# Altium project Ixora.PrjPCB (part 1 of 3)
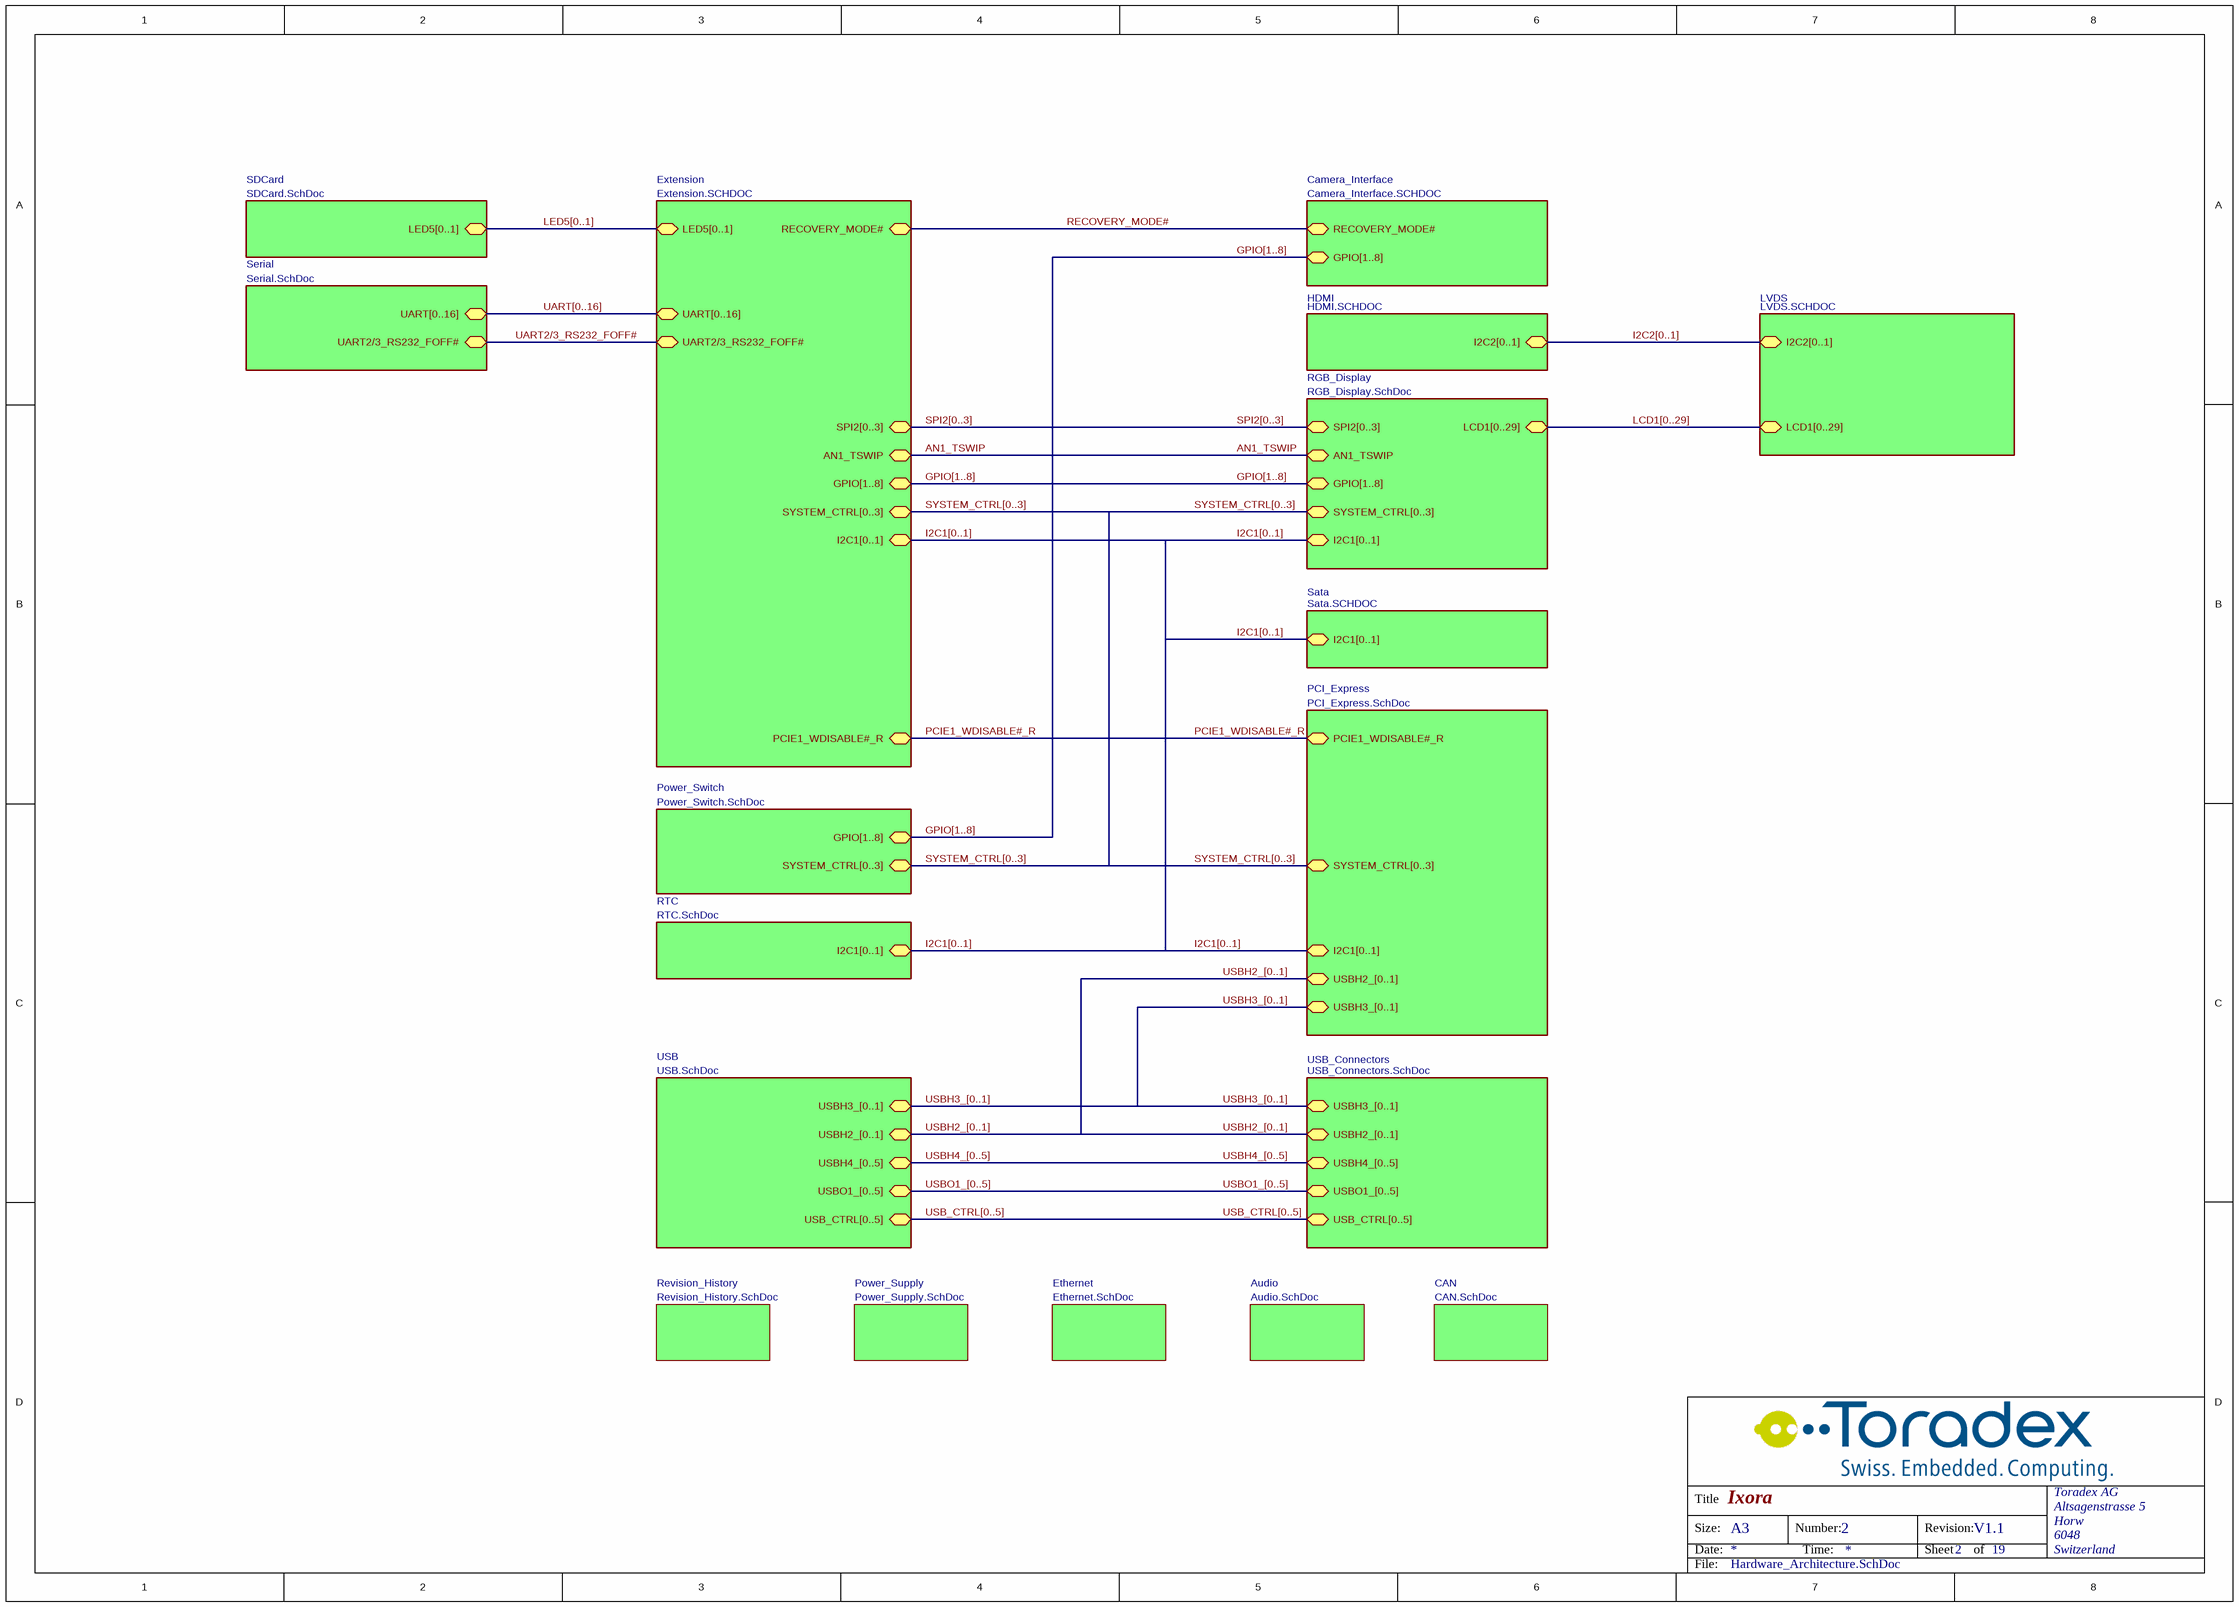
[diagram p0: Hardware_Architecture.SchDoc]
16 sheets, 410 parts. Net scope: global (net labels, ports and power ports of the same name join across sheets).
Board file: Ixora.PcbDoc
Sheets:
  Hardware_Architecture.SchDoc
    Audio = Audio.SchDoc
    Camera_Interface = Camera_Interface.SCHDOC
    Ethernet = Ethernet.SchDoc
    PCI_Express = PCI_Express.SchDoc
    Power_Supply = Power_Supply.SchDoc
    Power_Switch = Power_Switch.SchDoc
    RGB_Display = RGB_Display.SchDoc
    RTC = RTC.SchDoc
    Sata = Sata.SCHDOC
    SDCard = SDCard.SchDoc
    Serial = Serial.SchDoc
    Extension = Extension.SchDoc
    USB_Connectors = USB_Connectors.SchDoc
    USB = USB.SchDoc
    Revision_History = Revision_History.SchDoc

## Sheet Hardware_Architecture.SchDoc: Ixora
size A3; Organization: Toradex AG; Address1: Altsagenstrasse 5; Address2: Horw; Address3: 6048; Address4: Switzerland; DocumentNumber: 2; Revision: V1.1; SheetNumber: 2; SheetTotal: 19; PageSetup: Record=PageOptions|CenterHorizontal=True|CenterVertical=True|PrintScale=0.71|XCorrection=1.00|YCorrection=1.00|PrintKind=0|BorderSize=5000000|LeftOffset=0|BottomOffset=0|Orientation=2|PaperLength=1000|PaperWidth=1000|Scale=100|PaperSource=7|PrintQuality=600|MediaType=1|DitherType=10|PaperKind=A4|PrintScaleMode=1

### Sub-sheets
Audio = Audio.SchDoc: no entries
Camera_Interface = Camera_Interface.SCHDOC: RECOVERY_MODE# (bidir), GPIO[1..8] (bidir)
CAN = CAN.SchDoc (file not in this document): no entries
Ethernet = Ethernet.SchDoc: no entries
Extension = Extension.SCHDOC: AN1_TSWIP (bidir), GPIO[1..8] (bidir), UART[0..16] (bidir), I2C1[0..1] (bidir), SYSTEM_CTRL[0..3] (bidir), RECOVERY_MODE# (bidir), UART2/3_RS232_FOFF# (bidir), PCIE1_WDISABLE#_R (bidir), LED5[0..1] (bidir), SPI2[0..3] (bidir)
HDMI = HDMI.SCHDOC (file not in this document): I2C2[0..1] (bidir)
LVDS = LVDS.SCHDOC (file not in this document): LCD1[0..29] (bidir), I2C2[0..1] (bidir)
PCI_Express = PCI_Express.SchDoc: I2C1[0..1] (bidir), USBH2_[0..1] (bidir), SYSTEM_CTRL[0..3] (bidir), PCIE1_WDISABLE#_R (bidir), USBH3_[0..1] (bidir)
Power_Supply = Power_Supply.SchDoc: no entries
Power_Switch = Power_Switch.SchDoc: SYSTEM_CTRL[0..3] (bidir), GPIO[1..8] (bidir)
Revision_History = Revision_History.SchDoc: no entries
RGB_Display = RGB_Display.SchDoc: LCD1[0..29] (bidir), AN1_TSWIP (bidir), SYSTEM_CTRL[0..3] (bidir), GPIO[1..8] (bidir), SPI2[0..3] (bidir), I2C1[0..1] (bidir)
RTC = RTC.SchDoc: I2C1[0..1] (bidir)
Sata = Sata.SCHDOC: I2C1[0..1] (bidir)
SDCard = SDCard.SchDoc: LED5[0..1] (bidir)
Serial = Serial.SchDoc: UART[0..16] (bidir), UART2/3_RS232_FOFF# (bidir)
USB = USB.SchDoc: USBH2_[0..1] (bidir), USBO1_[0..5] (bidir), USBH4_[0..5] (bidir), USBH3_[0..1] (bidir), USB_CTRL[0..5] (bidir)
USB_Connectors = USB_Connectors.SchDoc: USBO1_[0..5] (bidir), USBH4_[0..5] (bidir), USBH3_[0..1] (bidir), USB_CTRL[0..5] (bidir), USBH2_[0..1] (bidir)

### Nets
AN1_TSWIP: sheet RGB_Display/AN1_TSWIP, sheet Extension/AN1_TSWIP
PCIE1_WDISABLE#_R: sheet PCI_Express/PCIE1_WDISABLE#_R, sheet Extension/PCIE1_WDISABLE#_R
RECOVERY_MODE#: sheet Camera_Interface/RECOVERY_MODE#, sheet Extension/RECOVERY_MODE#
UART2/3_RS232_FOFF#: sheet Serial/UART2/3_RS232_FOFF#, sheet Extension/UART2/3_RS232_FOFF#

### Buses and harness runs
bus GPIO[1..8] = sheet Camera_Interface/GPIO[1..8] = sheet Extension/GPIO[1..8] = sheet Power_Switch/GPIO[1..8] = sheet RGB_Display/GPIO[1..8]
bus I2C1[0..1] = sheet Extension/I2C1[0..1] = sheet PCI_Express/I2C1[0..1] = sheet RGB_Display/I2C1[0..1] = sheet RTC/I2C1[0..1] = sheet Sata/I2C1[0..1]
bus I2C2[0..1] = sheet HDMI/I2C2[0..1] = sheet LVDS/I2C2[0..1]
bus LCD1[0..29] = sheet LVDS/LCD1[0..29] = sheet RGB_Display/LCD1[0..29]
bus LED5[0..1] = sheet Extension/LED5[0..1] = sheet SDCard/LED5[0..1]
bus SPI2[0..3] = sheet Extension/SPI2[0..3] = sheet RGB_Display/SPI2[0..3]
bus SYSTEM_CTRL[0..3] = sheet Extension/SYSTEM_CTRL[0..3] = sheet PCI_Express/SYSTEM_CTRL[0..3] = sheet Power_Switch/SYSTEM_CTRL[0..3] = sheet RGB_Display/SYSTEM_CTRL[0..3]
bus UART[0..16] = sheet Extension/UART[0..16] = sheet Serial/UART[0..16]
bus USB_CTRL[0..5] = sheet USB/USB_CTRL[0..5] = sheet USB_Connectors/USB_CTRL[0..5]
bus USBH2_[0..1] = sheet PCI_Express/USBH2_[0..1] = sheet USB/USBH2_[0..1] = sheet USB_Connectors/USBH2_[0..1]
bus USBH3_[0..1] = sheet PCI_Express/USBH3_[0..1] = sheet USB/USBH3_[0..1] = sheet USB_Connectors/USBH3_[0..1]
bus USBH4_[0..5] = sheet USB/USBH4_[0..5] = sheet USB_Connectors/USBH4_[0..5]
bus USBO1_[0..5] = sheet USB/USBO1_[0..5] = sheet USB_Connectors/USBO1_[0..5]

### Notes on the sheet
- Title
- Size:
- Date:
- A3
- Number:
- Time:
- Revision:
- Sheet
- of
- File:

## Sheet Audio.SchDoc: Ixora
size A3; Organization: Toradex AG; Address1: Altsagenstrasse 5; Address2: Horw; Address3: 6048; Address4: Switzerland; DocumentNumber: 10; Revision: V1.1; SheetNumber: 10; SheetTotal: 19; PageSetup: Record=PageOptions|CenterHorizontal=True|CenterVertical=True|PrintScale=0.73|XCorrection=1.00|YCorrection=1.00|PrintKind=0|BorderSize=5000000|LeftOffset=0|BottomOffset=0|Orientation=2|PaperLength=1000|PaperWidth=1000|Scale=100|PaperSource=7|PrintQuality=-4|MediaType=1|DitherType=10|PaperKind=A4|PrintScaleMode=1
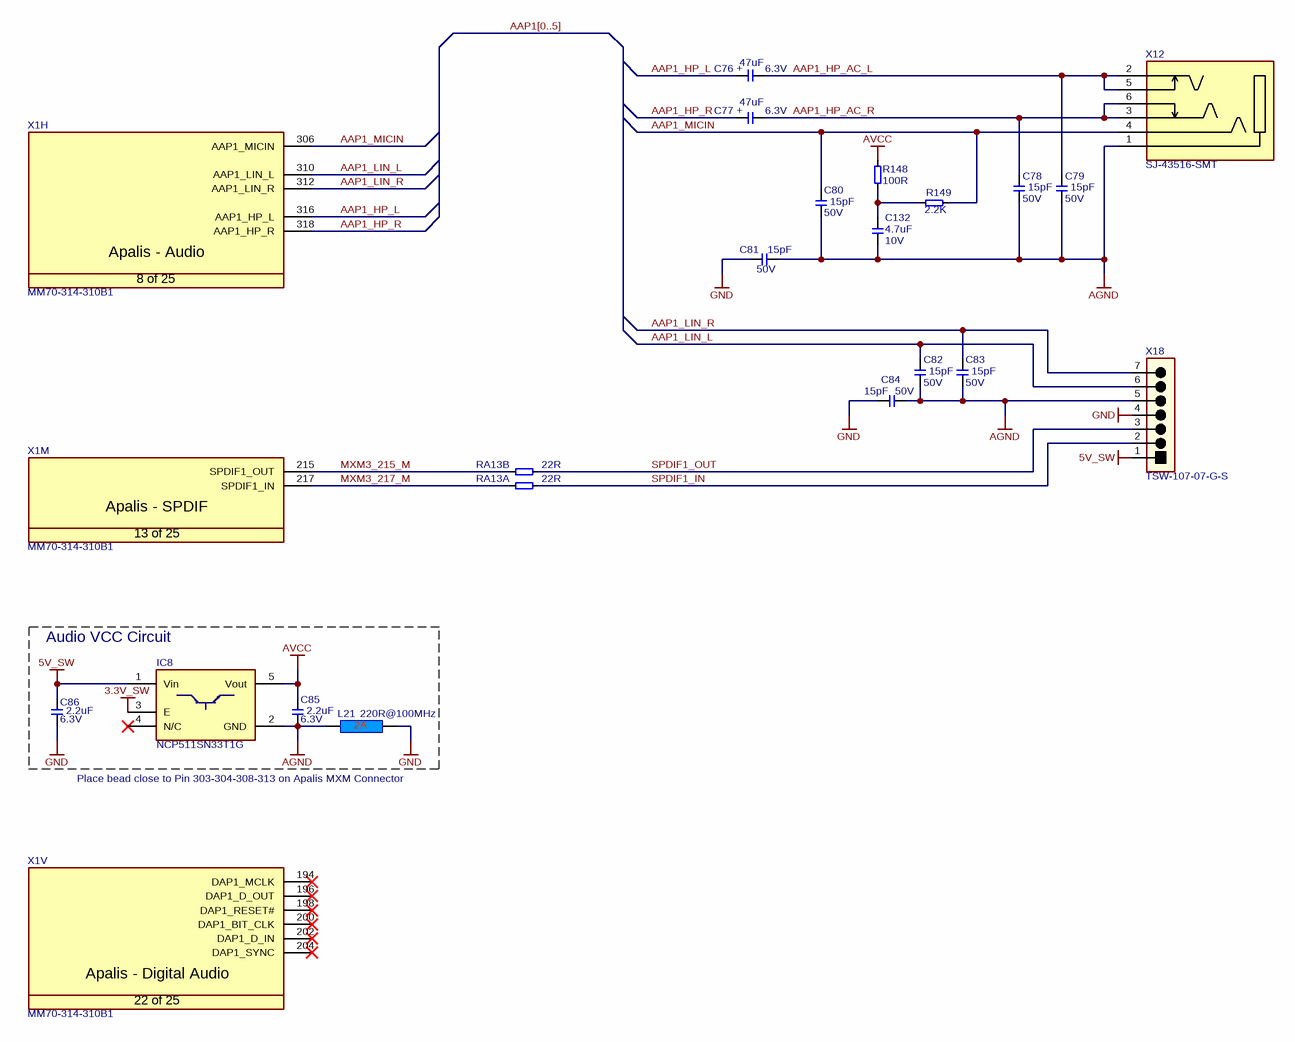
[diagram p1: Audio.SchDoc]

### Parts
C76  Rating: 6.3V  [T_CAPMP3216X180N]  (hidden comment: 47uF)
C77  Rating: 6.3V  [T_CAPMP3216X180N]  (hidden comment: 47uF)
C78  Rating: 50V  [T_CAPC0603X33N]  (hidden comment: 15pF)
C79  Rating: 50V  [T_CAPC0603X33N]  (hidden comment: 15pF)
C80  Rating: 50V  [T_CAPC0603X33N]  (hidden comment: 15pF)
C81  Rating: 50V  [T_CAPC0603X33N]  (hidden comment: 15pF)
C82  Rating: 50V  [T_CAPC0603X33N]  (hidden comment: 15pF)
C83  Rating: 50V  [T_CAPC0603X33N]  (hidden comment: 15pF)
C84  Rating: 50V  [T_CAPC0603X33N]  (hidden comment: 15pF)
C85  Rating: 6.3V  [T_CAPC0603X33N]  (hidden comment: 2.2uF)
C86  Rating: 6.3V  [T_CAPC0603X33N]  (hidden comment: 2.2uF)
C132  Rating: 10V  [T_CAPC0603X33N]  (hidden comment: 4.7uF)
IC8  NCP511SN33T1G  [SOT95P279X142-5N]
L21  220R@100MHz  [INDC1608X95N]
R148  100R  [RESC1005X40N]
R149  2.2K  [RESC1005X40N]
RA13  22R  [T_Resistor_Array_X4]  (parts A,B of 4)
X1  Manufacturer Part No.: MM70-314-310B1  [T_JAE_MM70-314-310B1]  (hidden comment: CON-JAE-MM70-314-310B1-314-0.5mm)  (parts H,M,V of 25)
X12  SJ-43516-SMT  [T_CI_SJ-43516-SMT]
X18  TSW-107-07-G-S  [T_samtech_TSW-107-07-G-S]

### Blocks framed on the sheet
Audio VCC Circuit: C85 C86 IC8 L21

### Nets
3.3V_SW: IC8.3(E)
5V_SW: C86.2 IC8.1(Vin) X18.1
AGND: C78.1 C79.1 C80.1 C81.2 C82.1 C83.1 C84.2 C85.1 C132.2 IC8.2(GND) L21.1 X12.1 X18.5
AVCC: C85.2 IC8.5(Vout) R148.2
GND: C81.1 C84.1 C86.1 L21.2 X18.4
AAP1_HP_AC_L: C76.2 C79.2 X12.2 X12.5
AAP1_HP_AC_R: C77.2 C78.2 X12.3 X12.6
AAP1_HP_L: C76.1 X1.316(AAP1_HP_L)
AAP1_HP_R: C77.1 X1.318(AAP1_HP_R)
AAP1_LIN_L: C82.2 X1.310(AAP1_LIN_L) X18.6
AAP1_LIN_R: C83.2 X1.312(AAP1_LIN_R) X18.7
AAP1_MICIN: C80.2 R149.1 X1.306(AAP1_MICIN) X12.4
MXM3_215_M: RA13.2 X1.215(SPDIF1_OUT)
MXM3_217_M: RA13.1 X1.217(SPDIF1_IN)
SPDIF1_IN: RA13.5 X18.2
SPDIF1_OUT: RA13.6 X18.3
NetC132_1: C132.1 R148.1 R149.2

Not connected (* = marked no-connect by the designer): IC8 4(N/C)*; X1 194(DAP1_MCLK)* 196(DAP1_D_OUT)* 198(DAP1_RESET#)* 200(DAP1_BIT_CLK)* 202(DAP1_D_IN)* 204(DAP1_SYNC)*

### Buses and harness runs
bus AAP1[0..5]

### Notes on the sheet
- Place bead close to Pin 303-304-308-313 on Apalis MXM Connector
- Title
- Size:
- Date:
- A3
- Number:
- Time:
- Revision:
- Sheet
- of
- File:
- (in symbol C-TA-47uF-6.3V-20%-3216) +
- (in symbol CON-JAE-MM70-314-310B1-314-0.5mm, part H) Apalis - Audio; 8 of 25
- (in symbol CON-JAE-MM70-314-310B1-314-0.5mm, part M) Apalis - SPDIF; 13 of 25
- (in symbol CON-JAE-MM70-314-310B1-314-0.5mm, part V) Apalis - Digital Audio; 22 of 25
- (in symbol CON-JAE-MM70-314-310B1-314-0.5mm, part O) Apalis - Dual Channel LVDS; 15 of 25

### Library data of the parts
C76 C77 = C-TA-47uF-6.3V-20%-3216: Capacitor TA 47uF 6.3V 20% 3216; Tolerance: 20%; Type: TA; Value: 47uF
C78-C84 = C-NP0-15pF-50V-10%-0603: Capacitor Ceramic NP0 15pF 50V 10% 0603; Tolerance: 10%; Type: NP0; Value: 15pF
C85 C86 = C-X5R-2.2uF-6.3V-20%-0603: Capacitor Ceramic X5R 2.2uF 6.3V 20% 0603; Tolerance: 20%; Type: X5R; Value: 2.2uF
C132 = C-X5R-4.7uF-10V-10%-0603: Capacitor Ceramic X5R 4.7uF 10V 10% 0603; Tolerance: 10%; Type: X5R; Value: 4.7uF
IC8 = IC-ON-NCP511SN33T1G: NCP511SN33T1G LDO Regulator; Manufacturer Name: ON Semiconductor; Manufacturer Part No.: NCP511SN33T1G
L21 = L-220R@100MHz-2A-25%-0603: 220R@100MHz 2A EMI FILTER; Tolerance: 25%; Rating: 2A; Value: 220R@100MHz
R148 = R-100R-63mW-5%-0402: Resistor 100 ohm 63mW 5% 0402; Rating: 63mW; Tolerance: 5%; Value: 100R
R149 = R-2.2KR-63mW-5%-0402: Resistor 2.2Kohm 63mW 5% 0402; Value: 2.2KR; Rating: 63mW; Tolerance: 5%
RA13 = RA-22R-63mW-5%-1206-div: Resistor Array 22 R 63mW 5% 1206; Tolerance: 5%; Power Dissipation: 63mW; Value: 22R
X1 = CON-JAE-MM70-314-310B1-314-0.5mm: MXM3 Connector; Manufacturer Name: JAE; No. of ways: 314
X12 = CON-Cui-SJ-43516-SMT-6-3.5mm: 3.5mm Stereo Jack SMD With Detect Contact; Manufacturer Name: Cui INC; No. of ways: 6; Manufacturer Part No.: SJ-43516-SMT
X18 = CON-Samtec-TSW-107-07-G-S: Header male, 1X7 Pins, 2.54 mm pitch; Manufacturer Name: Samtec; Pitch: 2.54 mm; No. of ways: 1X7; Manufacturer Part No.: TSW-107-07-G-S

## Sheet Camera_Interface.SCHDOC: Ixora
size A3; Organization: Toradex AG; Address1: Altsagenstrasse 5; Address2: Horw; Address3: 6048; Address4: Switzerland; DocumentNumber: 11; Revision: V1.1; SheetNumber: 11; SheetTotal: 19; PageSetup: Record=PageOptions|CenterHorizontal=True|CenterVertical=True|PrintScale=0.73|XCorrection=1.00|YCorrection=1.00|PrintKind=0|BorderSize=5000000|LeftOffset=0|BottomOffset=0|Orientation=2|PaperLength=1000|PaperWidth=1000|Scale=100|PaperSource=7|PrintQuality=-4|MediaType=1|DitherType=10|PaperKind=A4|PrintScaleMode=1
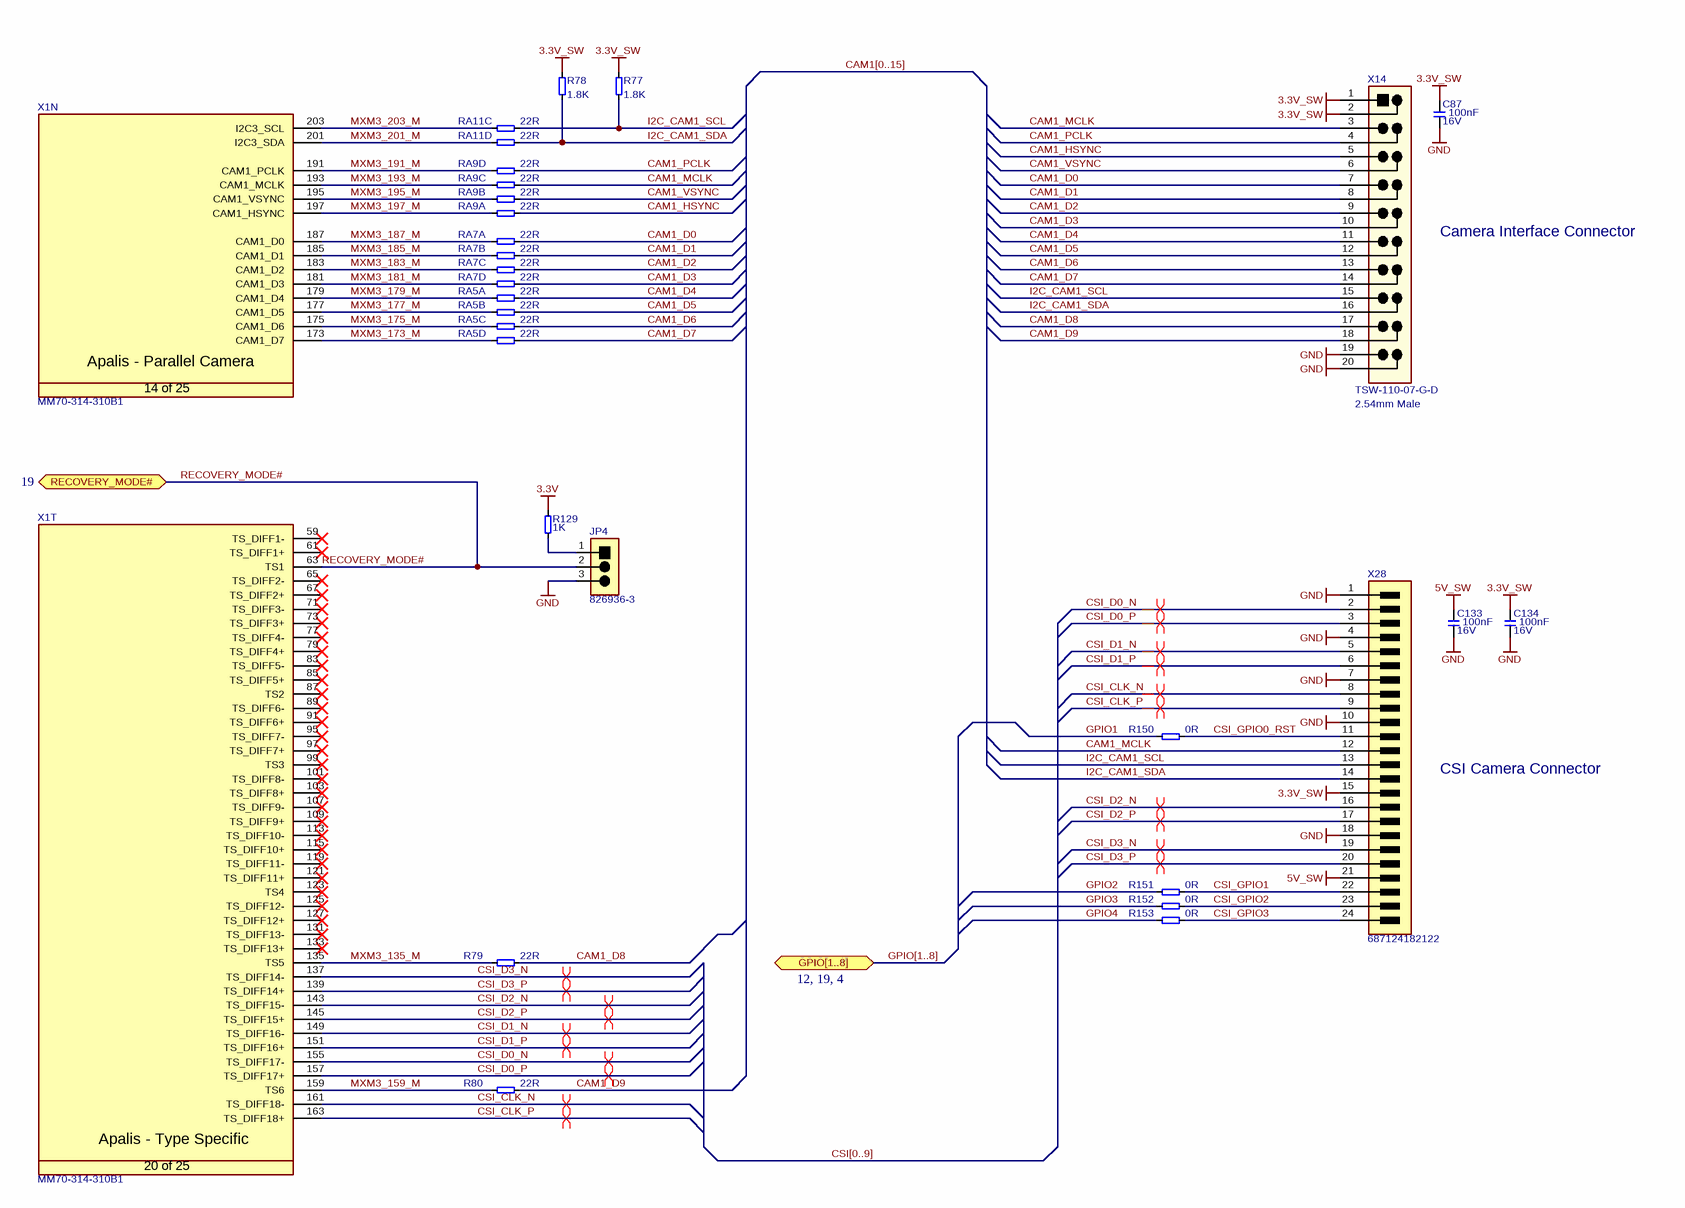
[diagram p2: Camera_Interface.SCHDOC]

### Parts
C87  Rating: 16V  [CAPC1005X60N]  (hidden comment: 100nF)
C133  Rating: 16V  [CAPC1005X60N]  (hidden comment: 100nF)
C134  Rating: 16V  [CAPC1005X60N]  (hidden comment: 100nF)
JP4  826936-3  [T_TYCO_826936-3]
R77  1.8K  [RESC1005X40N]
R78  1.8K  [RESC1005X40N]
R79  22R  [RESC1005X40N]
R80  22R  [RESC1005X40N]
R129  1K  [RESC1005X40N]
R150  0R  [RESC1005X40N]
R151  0R  [RESC1005X40N]
R152  0R  [RESC1005X40N]
R153  0R  [RESC1005X40N]
RA5  22R  [T_Resistor_Array_X4]  (parts A,B,C,D of 4)
RA7  22R  [T_Resistor_Array_X4]  (parts A,B,C,D of 4)
RA9  22R  [T_Resistor_Array_X4]  (parts A,B,C,D of 4)
RA11  22R  [T_Resistor_Array_X4]  (parts C,D of 4)
X1  Manufacturer Part No.: MM70-314-310B1  [T_JAE_MM70-314-310B1]  (hidden comment: CON-JAE-MM70-314-310B1-314-0.5mm)  (parts N,T of 25)
X14  TSW-110-07-G-D  [T_Samtec_TSW-110-07-G-D-Header]
X28  687124182122  [T_Wurth_687124182122 (Mirrored)]

### Ports
GPIO[1..8] (bidir, see 12, 19, 4), RECOVERY_MODE# (bidir, see 19)

### Nets
3.3V: R129.1
3.3V_SW: C87.2 C134.2 R77.1 R78.1 X14.1 X14.2 X28.15
5V_SW: C133.2 X28.21
GND: C87.1 C133.1 C134.1 JP4.3 X14.19 X14.20 X28.1 X28.4 X28.7 X28.10 X28.18
CAM1_D0: RA7.5 X14.7
CAM1_D1: RA7.6 X14.8
CAM1_D2: RA7.7 X14.9
CAM1_D3: RA7.8 X14.10
CAM1_D4: RA5.5 X14.11
CAM1_D5: RA5.6 X14.12
CAM1_D6: RA5.7 X14.13
CAM1_D7: RA5.8 X14.14
CAM1_D8: R79.2 X14.17
CAM1_D9: R80.2 X14.18
CAM1_HSYNC: RA9.5 X14.5
CAM1_MCLK: RA9.7 X14.3 X28.12
CAM1_PCLK: RA9.8 X14.4
CAM1_VSYNC: RA9.6 X14.6
CSI_CLK_N: X1.161(TS_DIFF18-) X28.8
CSI_CLK_P: X1.163(TS_DIFF18+) X28.9
CSI_D0_N: X1.155(TS_DIFF17-) X28.2
CSI_D0_P: X1.157(TS_DIFF17+) X28.3
CSI_D1_N: X1.149(TS_DIFF16-) X28.5
CSI_D1_P: X1.151(TS_DIFF16+) X28.6
CSI_D2_N: X1.143(TS_DIFF15-) X28.16
CSI_D2_P: X1.145(TS_DIFF15+) X28.17
CSI_D3_N: X1.137(TS_DIFF14-) X28.19
CSI_D3_P: X1.139(TS_DIFF14+) X28.20
CSI_GPIO0_RST: R150.1 X28.11
CSI_GPIO1: R151.1 X28.22
CSI_GPIO2: R152.1 X28.23
CSI_GPIO3: R153.1 X28.24
GPIO1: R150.2
GPIO2: R151.2
GPIO3: R152.2
GPIO4: R153.2
I2C_CAM1_SCL: R77.2 RA11.7 X14.15 X28.13
I2C_CAM1_SDA: R78.2 RA11.8 X14.16 X28.14
MXM3_135_M: R79.1 X1.135(TS5)
MXM3_159_M: R80.1 X1.159(TS6)
MXM3_173_M: RA5.4 X1.173(CAM1_D7)
MXM3_175_M: RA5.3 X1.175(CAM1_D6)
MXM3_177_M: RA5.2 X1.177(CAM1_D5)
MXM3_179_M: RA5.1 X1.179(CAM1_D4)
MXM3_181_M: RA7.4 X1.181(CAM1_D3)
MXM3_183_M: RA7.3 X1.183(CAM1_D2)
MXM3_185_M: RA7.2 X1.185(CAM1_D1)
MXM3_187_M: RA7.1 X1.187(CAM1_D0)
MXM3_191_M: RA9.4 X1.191(CAM1_PCLK)
MXM3_193_M: RA9.3 X1.193(CAM1_MCLK)
MXM3_195_M: RA9.2 X1.195(CAM1_VSYNC)
MXM3_197_M: RA9.1 X1.197(CAM1_HSYNC)
MXM3_201_M: RA11.4 X1.201(I2C3_SDA)
MXM3_203_M: RA11.3 X1.203(I2C3_SCL)
RECOVERY_MODE#: JP4.2 X1.63(TS1) ; port RECOVERY_MODE#
NetJP4_1: JP4.1 R129.2

Not connected (* = marked no-connect by the designer): X1 59(TS_DIFF1-)* 61(TS_DIFF1+)* 65(TS_DIFF2-)* 67(TS_DIFF2+)* 71(TS_DIFF3-)* 73(TS_DIFF3+)* 77(TS_DIFF4-)* 79(TS_DIFF4+)* 83(TS_DIFF5-)* 85(TS_DIFF5+)* 87(TS2)* 89(TS_DIFF6-)* 91(TS_DIFF6+)* 95(TS_DIFF7-)* 97(TS_DIFF7+)* 99(TS3)* 101(TS_DIFF8-)* 103(TS_DIFF8+)* 107(TS_DIFF9-)* 109(TS_DIFF9+)* 113(TS_DIFF10-)* 115(TS_DIFF10+)* 119(TS_DIFF11-)* 121(TS_DIFF11+)* 123(TS4)* 125(TS_DIFF12-)* 127(TS_DIFF12+)* 131(TS_DIFF13-)* 133(TS_DIFF13+)*

### Buses and harness runs
bus CAM1[0..15]
bus CSI[0..9]
bus GPIO[1..8] = port GPIO[1..8]

### Layout directives
differential pair: CSI_CLK_N, CSI_CLK_P, CSI_D0_N, CSI_D0_P, CSI_D1_N, CSI_D1_P, CSI_D2_N, CSI_D2_P, CSI_D3_N, CSI_D3_P

### Notes on the sheet
- Camera Interface Connector
- (near X14) 2.54mm Male
- CSI Camera Connector
- Title
- Size:
- Date:
- A3
- Number:
- Time:
- Revision:
- Sheet
- of
- File:
- (in symbol CON-JAE-MM70-314-310B1-314-0.5mm, part N) Apalis - Parallel Camera; 14 of 25
- (in symbol CON-JAE-MM70-314-310B1-314-0.5mm, part T) Apalis - Type Specific; 20 of 25

### Library data of the parts
C87 C133 C134 = C-X7R-100nF-16V-10%-0402: Capacitor Ceramic X7R 100nF 16V 10% 0402; Tolerance: 10%; Type: X7R; Value: 100nF
JP4 = CON-Tyco-826936-3-1X3-2.54mm-JP: Jumper, 3-Pin; Manufacturer Name: Tyco; No. of ways: 1X3; Pitch: 2.54mm; Manufacturer Part No.: 826936-3
R77 R78 = R-1.8KR-63mW-5%-0402: Resistor 1.8 Kohm 63mW 5% 0402; Value: 1.8KR; Rating: 63mW; Tolerance: 5%
R79 R80 = R-22R-63mW-5%-0402: Resistor 22 ohm 63mW 5% 0402; Rating: 63mW; Tolerance: 5%; Value: 22R
R129 = R-1KR-63mW-5%-0402: Resistor 1 Kohm 63mW 5% 0402; Rating: 63mW; Tolerance: 5%; Value: 1K
R150-R153 = R-0R-63mW-1%-0402: Resistor 0 ohm 63mW 1% 0402; Rating: 63mW; Tolerance: 1%; Value: 0R
RA5 RA7 RA9 RA11 = RA-22R-63mW-5%-1206-div: Resistor Array 22 R 63mW 5% 1206; Tolerance: 5%; Power Dissipation: 63mW
  RA5 RA7 RA11: Value: 22R
X1 = CON-JAE-MM70-314-310B1-314-0.5mm: as X1 on sheet Audio
X14 = CON-Samtec-TSW-110-07-G-D-Header: Header male, 2x10 pin 2.54mm pitch; Manufacturer Name: Samtec; No. of ways: 2x10; Pitch: 2.54mm; Manufacturer Part No.: TSW-110-07-G-D
X28 = CON-Wurth-687124182122 (Mirrored): FFC/FPC Connector, 24 Position, Top and Bottom 0.020" (0.50mm) Surface Mount, Right Angle; Manufacturer Name: Wurth; No. of ways: 24; Pitch: 0.5mm; Manufacturer Part No.: 687124182122

## Sheet Ethernet.SchDoc: Ixora
size A3; Organization: Toradex AG; Address1: Altsagenstrasse 5; Address2: Horw; Address3: 6048; Address4: Switzerland; DocumentNumber: 9; Revision: V1.1; SheetNumber: 9; SheetTotal: 19; PageSetup: Record=PageOptions|CenterHorizontal=True|CenterVertical=True|PrintScale=0.73|XCorrection=1.00|YCorrection=1.00|PrintKind=0|BorderSize=5000000|LeftOffset=0|BottomOffset=0|Orientation=2|PaperLength=1000|PaperWidth=1000|Scale=100|PaperSource=7|PrintQuality=-4|MediaType=1|DitherType=10|PaperKind=A4|PrintScaleMode=1
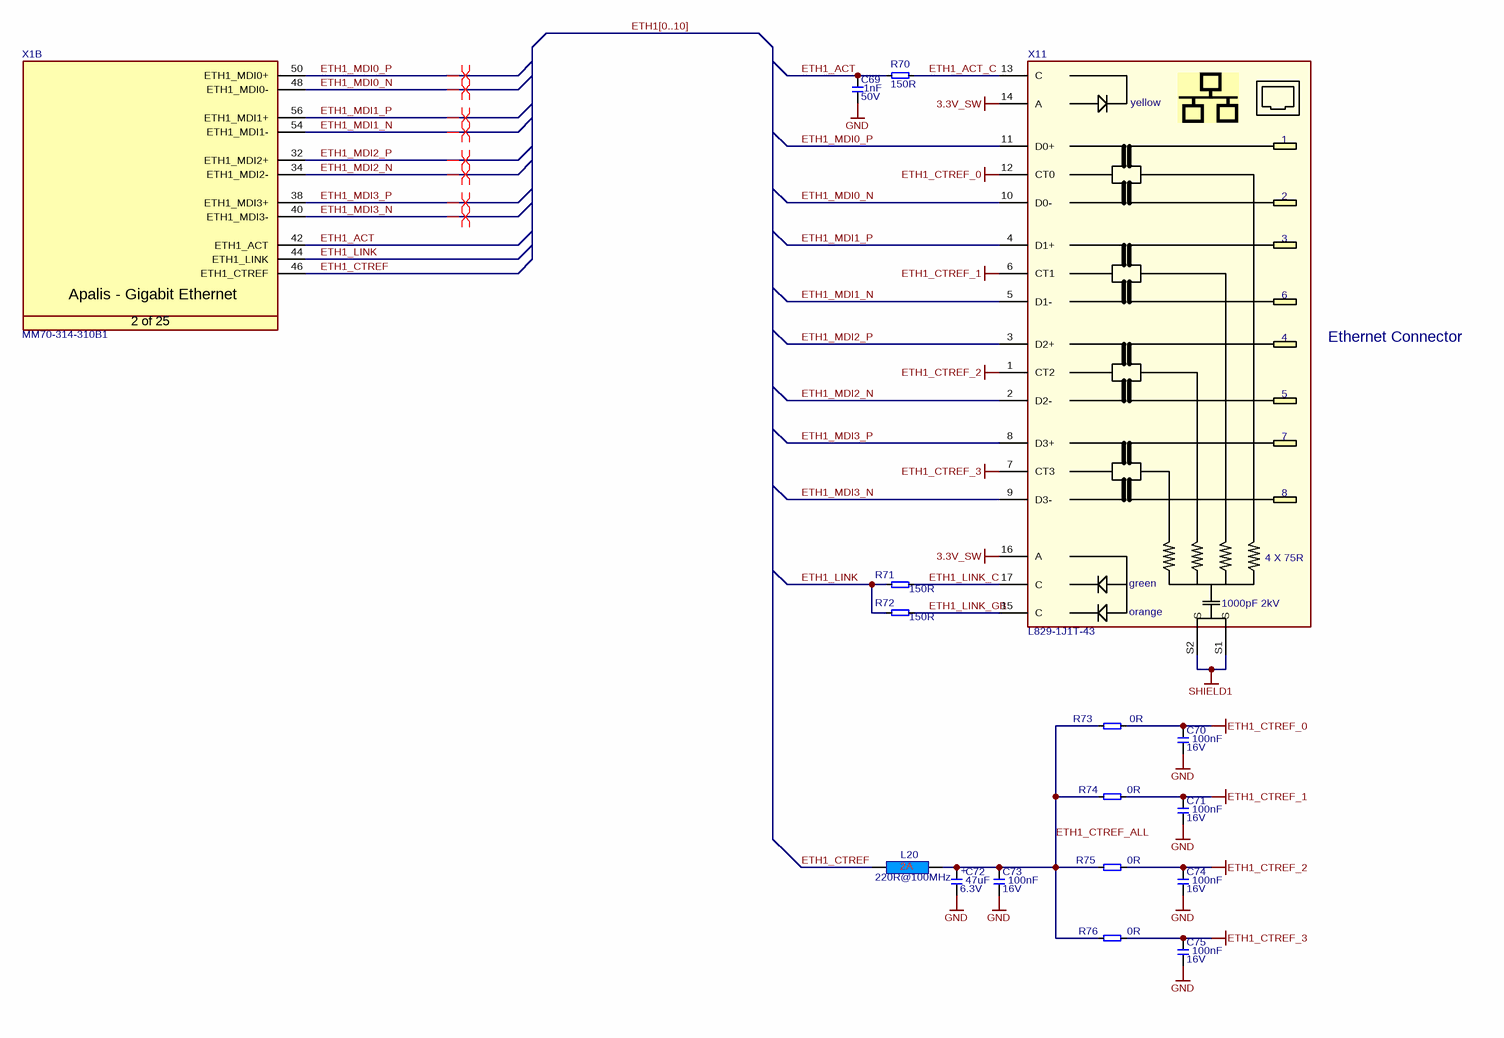
[diagram p3: Ethernet.SchDoc]

### Parts
C69  Rating: 50V  [CAPC1005X60N]  (hidden comment: 1nF)
C70  Rating: 16V  [CAPC1005X60N]  (hidden comment: 100nF)
C71  Rating: 16V  [CAPC1005X60N]  (hidden comment: 100nF)
C72  Rating: 6.3V  [T_CAPMP3216X180N]  (hidden comment: 47uF)
C73  Rating: 16V  [CAPC1005X60N]  (hidden comment: 100nF)
C74  Rating: 16V  [CAPC1005X60N]  (hidden comment: 100nF)
C75  Rating: 16V  [CAPC1005X60N]  (hidden comment: 100nF)
L20  220R@100MHz  [INDC1608X95N]
R70  150R  [RESC1005X40N]
R71  150R  [RESC1005X40N]
R72  150R  [RESC1005X40N]
R73  0R  [RESC1005X40N]
R74  0R  [RESC1005X40N]
R75  0R  [RESC1005X40N]
R76  0R  [RESC1005X40N]
X1  Manufacturer Part No.: MM70-314-310B1  [T_JAE_MM70-314-310B1]  (hidden comment: CON-JAE-MM70-314-310B1-314-0.5mm)  (part B of 25)
X11  L829-1J1T-43  [T_BEL_L829-1J1T-43]

### Nets
3.3V_SW: X11.14(A) X11.16(A)
ETH1_CTREF_0: C70.2 R73.2 X11.12(CT0)
ETH1_CTREF_1: C71.2 R74.2 X11.6(CT1)
ETH1_CTREF_2: C74.2 R75.2 X11.1(CT2)
ETH1_CTREF_3: C75.2 R76.2 X11.7(CT3)
GND: C69.1 C70.1 C71.1 C72.2 C73.1 C74.1 C75.1
SHIELD1: X11.S1(S) X11.S2(S)
ETH1_ACT: C69.2 R70.1 X1.42(ETH1_ACT)
ETH1_ACT_C: R70.2 X11.13(C)
ETH1_CTREF: L20.1 X1.46(ETH1_CTREF)
ETH1_CTREF_ALL: C72.1 C73.2 L20.2 R73.1 R74.1 R75.1 R76.1
ETH1_LINK: R71.1 R72.1 X1.44(ETH1_LINK)
ETH1_LINK_C: R71.2 X11.17(C)
ETH1_LINK_GB: R72.2 X11.15(C)
ETH1_MDI0_N: X1.48(ETH1_MDI0-) X11.10(D0-)
ETH1_MDI0_P: X1.50(ETH1_MDI0+) X11.11(D0+)
ETH1_MDI1_N: X1.54(ETH1_MDI1-) X11.5(D1-)
ETH1_MDI1_P: X1.56(ETH1_MDI1+) X11.4(D1+)
ETH1_MDI2_N: X1.34(ETH1_MDI2-) X11.2(D2-)
ETH1_MDI2_P: X1.32(ETH1_MDI2+) X11.3(D2+)
ETH1_MDI3_N: X1.40(ETH1_MDI3-) X11.9(D3-)
ETH1_MDI3_P: X1.38(ETH1_MDI3+) X11.8(D3+)

### Buses and harness runs
bus ETH1[0..10]

### Layout directives
differential pair: ETH1_MDI0_N, ETH1_MDI0_P, ETH1_MDI1_N, ETH1_MDI1_P, ETH1_MDI2_N, ETH1_MDI2_P, ETH1_MDI3_N, ETH1_MDI3_P

### Notes on the sheet
- Ethernet Connector
- Title
- Size:
- Date:
- A3
- Number:
- Time:
- Revision:
- Sheet
- of
- File:
- (in symbol C-TA-47uF-6.3V-20%-3216) +
- (in symbol CON-BEL-L829-1J1T-43) yellow; 4 X 75R; green; 1000pF 2kV; orange
- (in symbol CON-JAE-MM70-314-310B1-314-0.5mm, part B) Apalis - Gigabit Ethernet; 2 of 25

### Library data of the parts
C69 = C-X7R-1nF-50V-10%-0402: Capacitor Ceramic X7R 1nF 50V 10% 0402; Tolerance: 10%; Type: X7R; Value: 1nF
C70 C71 C73-C75 = C-X7R-100nF-16V-10%-0402: Capacitor Ceramic X7R 100nF 16V 10% 0402; Tolerance: 10%; Type: X7R; Value: 100nF
C72 = C-TA-47uF-6.3V-20%-3216: Capacitor TA 47uF 6.3V 20% 3216; Tolerance: 20%; Type: TA; Value: 47uF
L20 = L-220R@100MHz-2A-25%-0603: as L21 on sheet Audio; Rating: 2A; Value: 220R@100MHz
R70-R72 = R-150R-63mW-1%-0402: Resistor 150 ohm 63mW 1% 0402; Tolerance: 1%; Value: 150R; Rating: 63mW
R73-R76 = R-0R-63mW-1%-0402: Resistor 0 ohm 63mW 1% 0402; Rating: 63mW; Tolerance: 1%; Value: 0R
X1 = CON-JAE-MM70-314-310B1-314-0.5mm: as X1 on sheet Audio
X11 = CON-BEL-L829-1J1T-43: Low profile 10/100/1G Mag Jack; Manufacturer Name: BEL; Manufacturer Part No.: L829-1J1T-43

## Sheet PCI_Express.SchDoc: Ixora
size A3; Organization: Toradex AG; Address1: Altsagenstrasse 5; Address2: Horw; Address3: 6048; Address4: Switzerland; DocumentNumber: 18; Revision: V1.1; SheetNumber: 18; SheetTotal: 19; PageSetup: Record=PageOptions|CenterHorizontal=True|CenterVertical=True|PrintScale=0.73|XCorrection=1.00|YCorrection=1.00|PrintKind=0|BorderSize=5000000|LeftOffset=0|BottomOffset=0|Orientation=2|PaperLength=1000|PaperWidth=1000|Scale=100|PaperSource=7|PrintQuality=-4|MediaType=1|DitherType=10|PaperKind=A4|PrintScaleMode=1
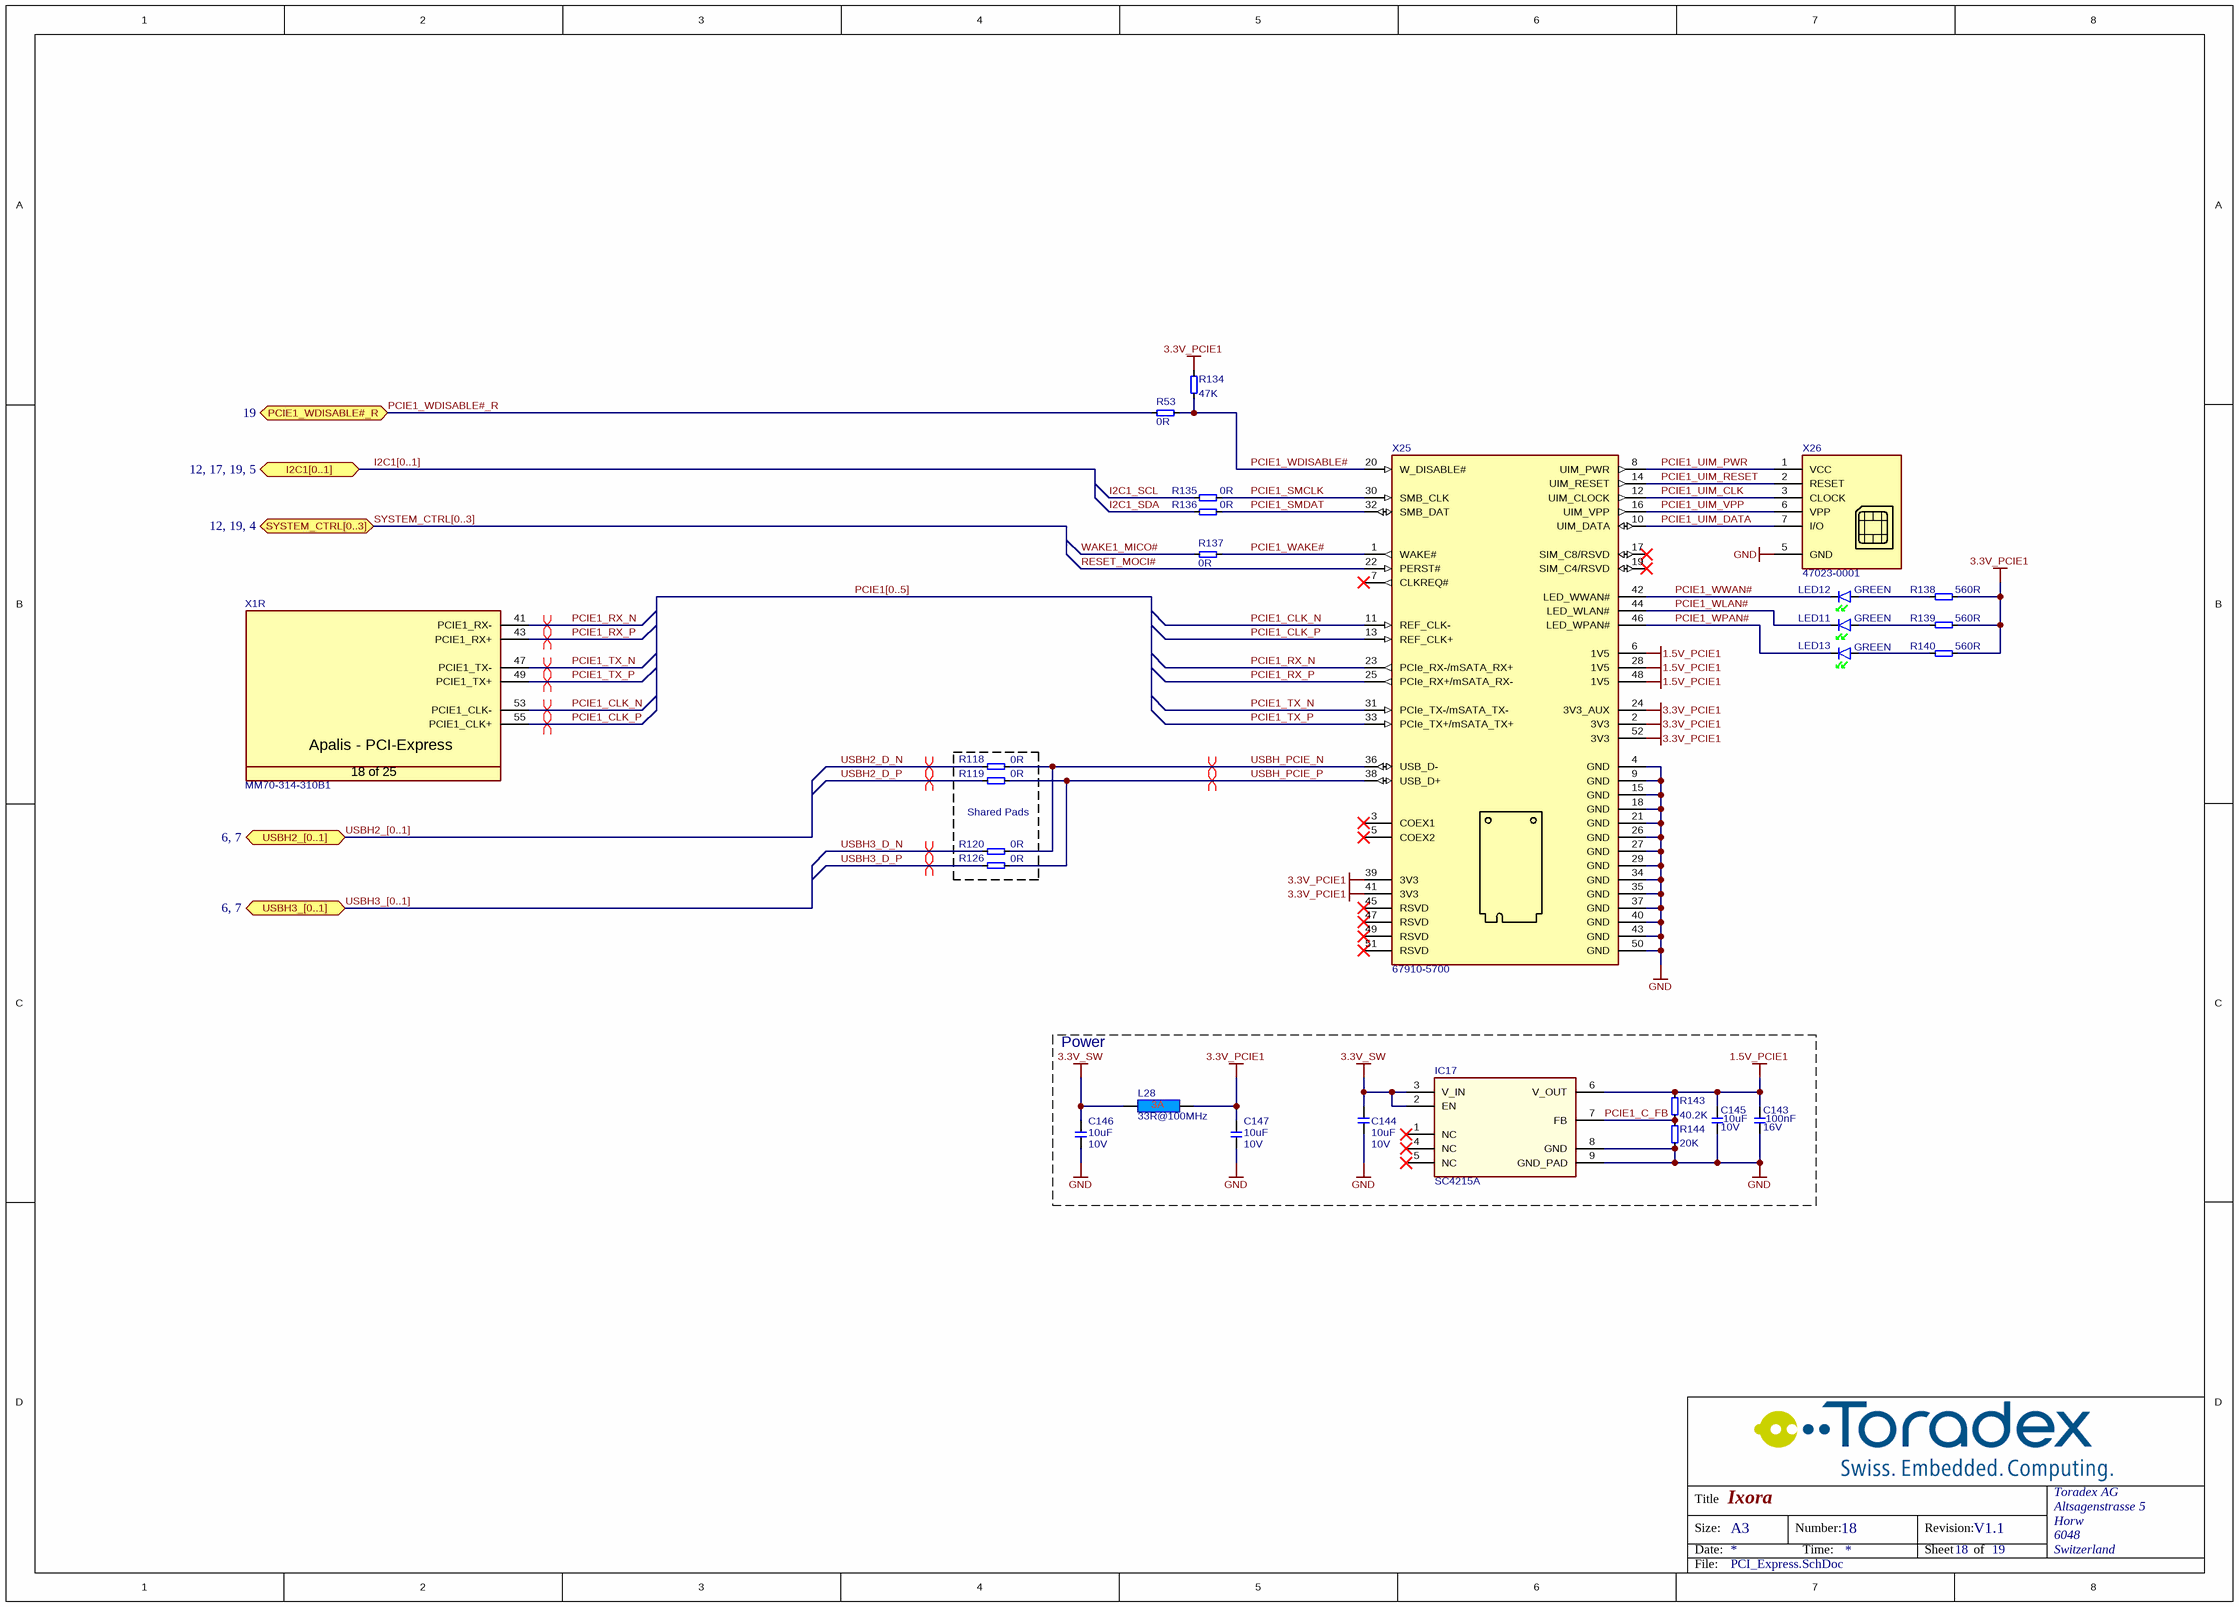
[diagram p4: PCI_Express.SchDoc]

### Parts
C143  Rating: 16V  [CAPC1005X60N]  (hidden comment: 100nF)
C144  Rating: 10V  [T_CAPC0603X33N]  (hidden comment: 10uF)
C145  Rating: 10V  [T_CAPC0603X33N]  (hidden comment: 10uF)
C146  Rating: 10V  [T_CAPC0603X33N]  (hidden comment: 10uF)
C147  Rating: 10V  [T_CAPC0603X33N]  (hidden comment: 10uF)
IC17  Manufacturer Part No.: SC4215A  [SOIC127P650X175_HS-8N]  (hidden comment: IC-Semtech-SC4215A)
L28  33R@100MHz  [INDC1608X95N]
LED11  Color: GREEN  [T_Kingbright_APA1606CGCK]  (hidden comment: APA1606CGCK)
LED12  Color: GREEN  [T_Kingbright_APA1606CGCK]  (hidden comment: APA1606CGCK)
LED13  Color: GREEN  [T_Kingbright_APA1606CGCK]  (hidden comment: APA1606CGCK)
R53  0R  [T_RESC0603X30N]
R118  0R  [T_RESC0603X30N]
R119  0R  [T_RESC0603X30N]
R120  0R  [T_RESC0603X30N]
R126  0R  [T_RESC0603X30N]
R134  47K  [T_RESC0603X30N]
R135  0R  [RESC1005X40N]
R136  0R  [RESC1005X40N]
R137  0R  [T_RESC0603X30N]
R138  560R  [RESC1005X40N]
R139  560R  [RESC1005X40N]
R140  560R  [RESC1005X40N]
R143  40.2K  [RESC1005X40N]
R144  20K  [RESC1005X40N]
X1  Manufacturer Part No.: MM70-314-310B1  [T_JAE_MM70-314-310B1]  (hidden comment: CON-JAE-MM70-314-310B1-314-0.5mm)  (part R of 25)
X25  67910-5700  [T_Molex_67910-5700]
X26  47023-0001  [T_Molex_47023-0001]

### Blocks framed on the sheet
Shared Pads: R118-R120 R126
Power: C143-C147 IC17 L28 R143 R144

### Ports
I2C1[0..1] (bidir, see 12, 17, 19, 5), PCIE1_WDISABLE#_R (bidir, see 19), SYSTEM_CTRL[0..3] (bidir, see 12, 19, 4), USBH2_[0..1] (bidir, see 6, 7), USBH3_[0..1] (bidir, see 6, 7)

### Nets
1.5V_PCIE1: C143.2 C145.2 IC17.6(V_OUT) R143.2 X25.6(1V5) X25.28(1V5) X25.48(1V5)
3.3V_PCIE1: C147.2 L28.2 R134.2 R138.1 R139.1 R140.1 X25.2(3V3) X25.24(3V3_AUX) X25.39(3V3) X25.41(3V3) X25.52(3V3)
3.3V_SW: C144.2 C146.2 IC17.2(EN) IC17.3(V_IN) L28.1
GND: C143.1 C144.1 C145.1 C146.1 C147.1 IC17.8(GND) IC17.9(GND_PAD) R144.1 X25.4(GND) X25.9(GND) X25.15(GND) X25.18(GND) X25.21(GND) X25.26(GND) X25.27(GND) X25.29(GND) X25.34(GND) X25.35(GND) X25.37(GND) X25.40(GND) X25.43(GND) X25.50(GND) X26.5(GND)
I2C1_SCL: R135.1
I2C1_SDA: R136.1
PCIE1_C_FB: IC17.7(FB) R143.1 R144.2
PCIE1_CLK_N: X1.53(PCIE1_CLK-) X25.11(REF_CLK-)
PCIE1_CLK_P: X1.55(PCIE1_CLK+) X25.13(REF_CLK+)
PCIE1_RX_N: X1.41(PCIE1_RX-) X25.23(PCIe_RX-/mSATA_RX+)
PCIE1_RX_P: X1.43(PCIE1_RX+) X25.25(PCIe_RX+/mSATA_RX-)
PCIE1_SMCLK: R135.2 X25.30(SMB_CLK)
PCIE1_SMDAT: R136.2 X25.32(SMB_DAT)
PCIE1_TX_N: X1.47(PCIE1_TX-) X25.31(PCIe_TX-/mSATA_TX-)
PCIE1_TX_P: X1.49(PCIE1_TX+) X25.33(PCIe_TX+/mSATA_TX+)
PCIE1_UIM_CLK: X25.12(UIM_CLOCK) X26.3(CLOCK)
PCIE1_UIM_DATA: X25.10(UIM_DATA) X26.7(I/O)
PCIE1_UIM_PWR: X25.8(UIM_PWR) X26.1(VCC)
PCIE1_UIM_RESET: X25.14(UIM_RESET) X26.2(RESET)
PCIE1_UIM_VPP: X25.16(UIM_VPP) X26.6(VPP)
PCIE1_WAKE#: R137.2 X25.1(WAKE#)
PCIE1_WDISABLE#: R53.1 R134.1 X25.20(W_DISABLE#)
PCIE1_WDISABLE#_R: R53.2 ; port PCIE1_WDISABLE#_R
PCIE1_WLAN#: LED11.1(K) X25.44(LED_WLAN#)
PCIE1_WPAN#: LED13.1(K) X25.46(LED_WPAN#)
PCIE1_WWAN#: LED12.1(K) X25.42(LED_WWAN#)
RESET_MOCI#: X25.22(PERST#)
USBH2_D_N: R118.1
USBH2_D_P: R119.1
USBH3_D_N: R120.1
USBH3_D_P: R126.1
USBH_PCIE_N: R118.2 R120.2 X25.36(USB_D-)
USBH_PCIE_P: R119.2 R126.2 X25.38(USB_D+)
WAKE1_MICO#: R137.1
NetLED11_2: LED11.2(A) R139.2
NetLED12_2: LED12.2(A) R138.2
NetLED13_2: LED13.2(A) R140.2

Not connected (* = marked no-connect by the designer): IC17 1(NC)* 4(NC)* 5(NC)*; X25 3(COEX1)* 5(COEX2)* 7(CLKREQ#)* 17(SIM_C8/RSVD)* 19(SIM_C4/RSVD)* 45(RSVD)* 47(RSVD)* 49(RSVD)* 51(RSVD)*

### Buses and harness runs
bus I2C1[0..1] = port I2C1[0..1]
bus PCIE1[0..5]
bus SYSTEM_CTRL[0..3] = port SYSTEM_CTRL[0..3]
bus USBH2_[0..1] = port USBH2_[0..1]
bus USBH3_[0..1] = port USBH3_[0..1]

### Layout directives
differential pair: PCIE1_CLK_N, PCIE1_CLK_P, PCIE1_RX_N, PCIE1_RX_P, PCIE1_TX_N, PCIE1_TX_P, USBH2_D_N, USBH2_D_P, USBH3_D_N, USBH3_D_P, USBH_PCIE_N, USBH_PCIE_P

### Notes on the sheet
- Title
- Size:
- Date:
- A3
- Number:
- Time:
- Revision:
- Sheet
- of
- File:
- (in symbol CON-JAE-MM70-314-310B1-314-0.5mm, part R) Apalis - PCI-Express; 18 of 25

### Library data of the parts
C143 = C-X7R-100nF-16V-10%-0402: Capacitor Ceramic X7R 100nF 16V 10% 0402; Tolerance: 10%; Type: X7R; Value: 100nF
C144-C147 = C-X5R-10uF-10V-20%-0603: Capacitor Ceramic X5R 10uF 10V 20% 0603; Tolerance: 20%; Type: X5R; Value: 10uF
IC17 = IC-Semtech-SC4215A: LDO TO 2A; Manufacturer Name: Semtech
L28 = L-33R@100MHz-3A-25%-0603: 33R@100MHz 3A EMI FILTER; Tolerance: 25%; Rating: 3A; Value: 33R@100MHz
LED11-LED13 = LED-Kingbright-APA1606CGCK: LED green Kingbright APA1606CGCK; Manufacturer Name: Kingbright; Manufacturer Part No.: APA1606CGCK
R53 R118-R120 R126 R137 = R-0R-63mW-1%-0603: Resistor 0 ohm 63mW 1% 0603; Rating: 63mW; Tolerance: 1%; Value: 0R
R134 = R-47KR-63mW-5%-0603: Resistor 47 Kohm 63mW 5% 0603; Value: 47KR; Rating: 63mW; Tolerance: 5%
R135 R136 = R-0R-63mW-1%-0402: Resistor 0 ohm 63mW 1% 0402; Rating: 63mW; Tolerance: 1%; Value: 0R
R138-R140 = R-560R-63mW-5%-0402: Resistor 560 ohm 63mW 5% 0402; Rating: 63mW; Tolerance: 5%; Value: 560R
R143 = R-40.2KR-63mW-1%-0402: Resistor 40.2 Kohm 63mW 1% 0402; Value: 40.2KR; Rating: 63mW; Tolerance: 1%
R144 = R-20KR-63mW-1%-0402: Resistor 20 Kohm 63mW 1% 0402; Value: 20KR; Rating: 63mW; Tolerance: 1%
X1 = CON-JAE-MM70-314-310B1-314-0.5mm: as X1 on sheet Audio
X25 = CON-Molex-67910-5700: PCIe_Mini Card Holder; Manufacturer Name: Molex; Part No.: 67910-5700
X26 = CON-Molex-47023-0001: 6 Contacts Mini Sim Card Holder; Manufacturer Name: Molex; Part No.: 47023-0001

## Sheet Power_Supply.SchDoc: Ixora
size A3; Organization: Toradex AG; Address1: Altsagenstrasse 5; Address2: Horw; Address3: 6048; Address4: Switzerland; DocumentNumber: 3; Revision: V1.1; SheetNumber: 3; SheetTotal: 19; PageSetup: Record=PageOptions|CenterHorizontal=True|CenterVertical=True|PrintScale=0.73|XCorrection=1.00|YCorrection=1.00|PrintKind=0|BorderSize=5000000|LeftOffset=0|BottomOffset=0|Orientation=2|PaperLength=1000|PaperWidth=1000|Scale=100|PaperSource=7|PrintQuality=-4|MediaType=1|DitherType=10|PaperKind=A4|PrintScaleMode=1
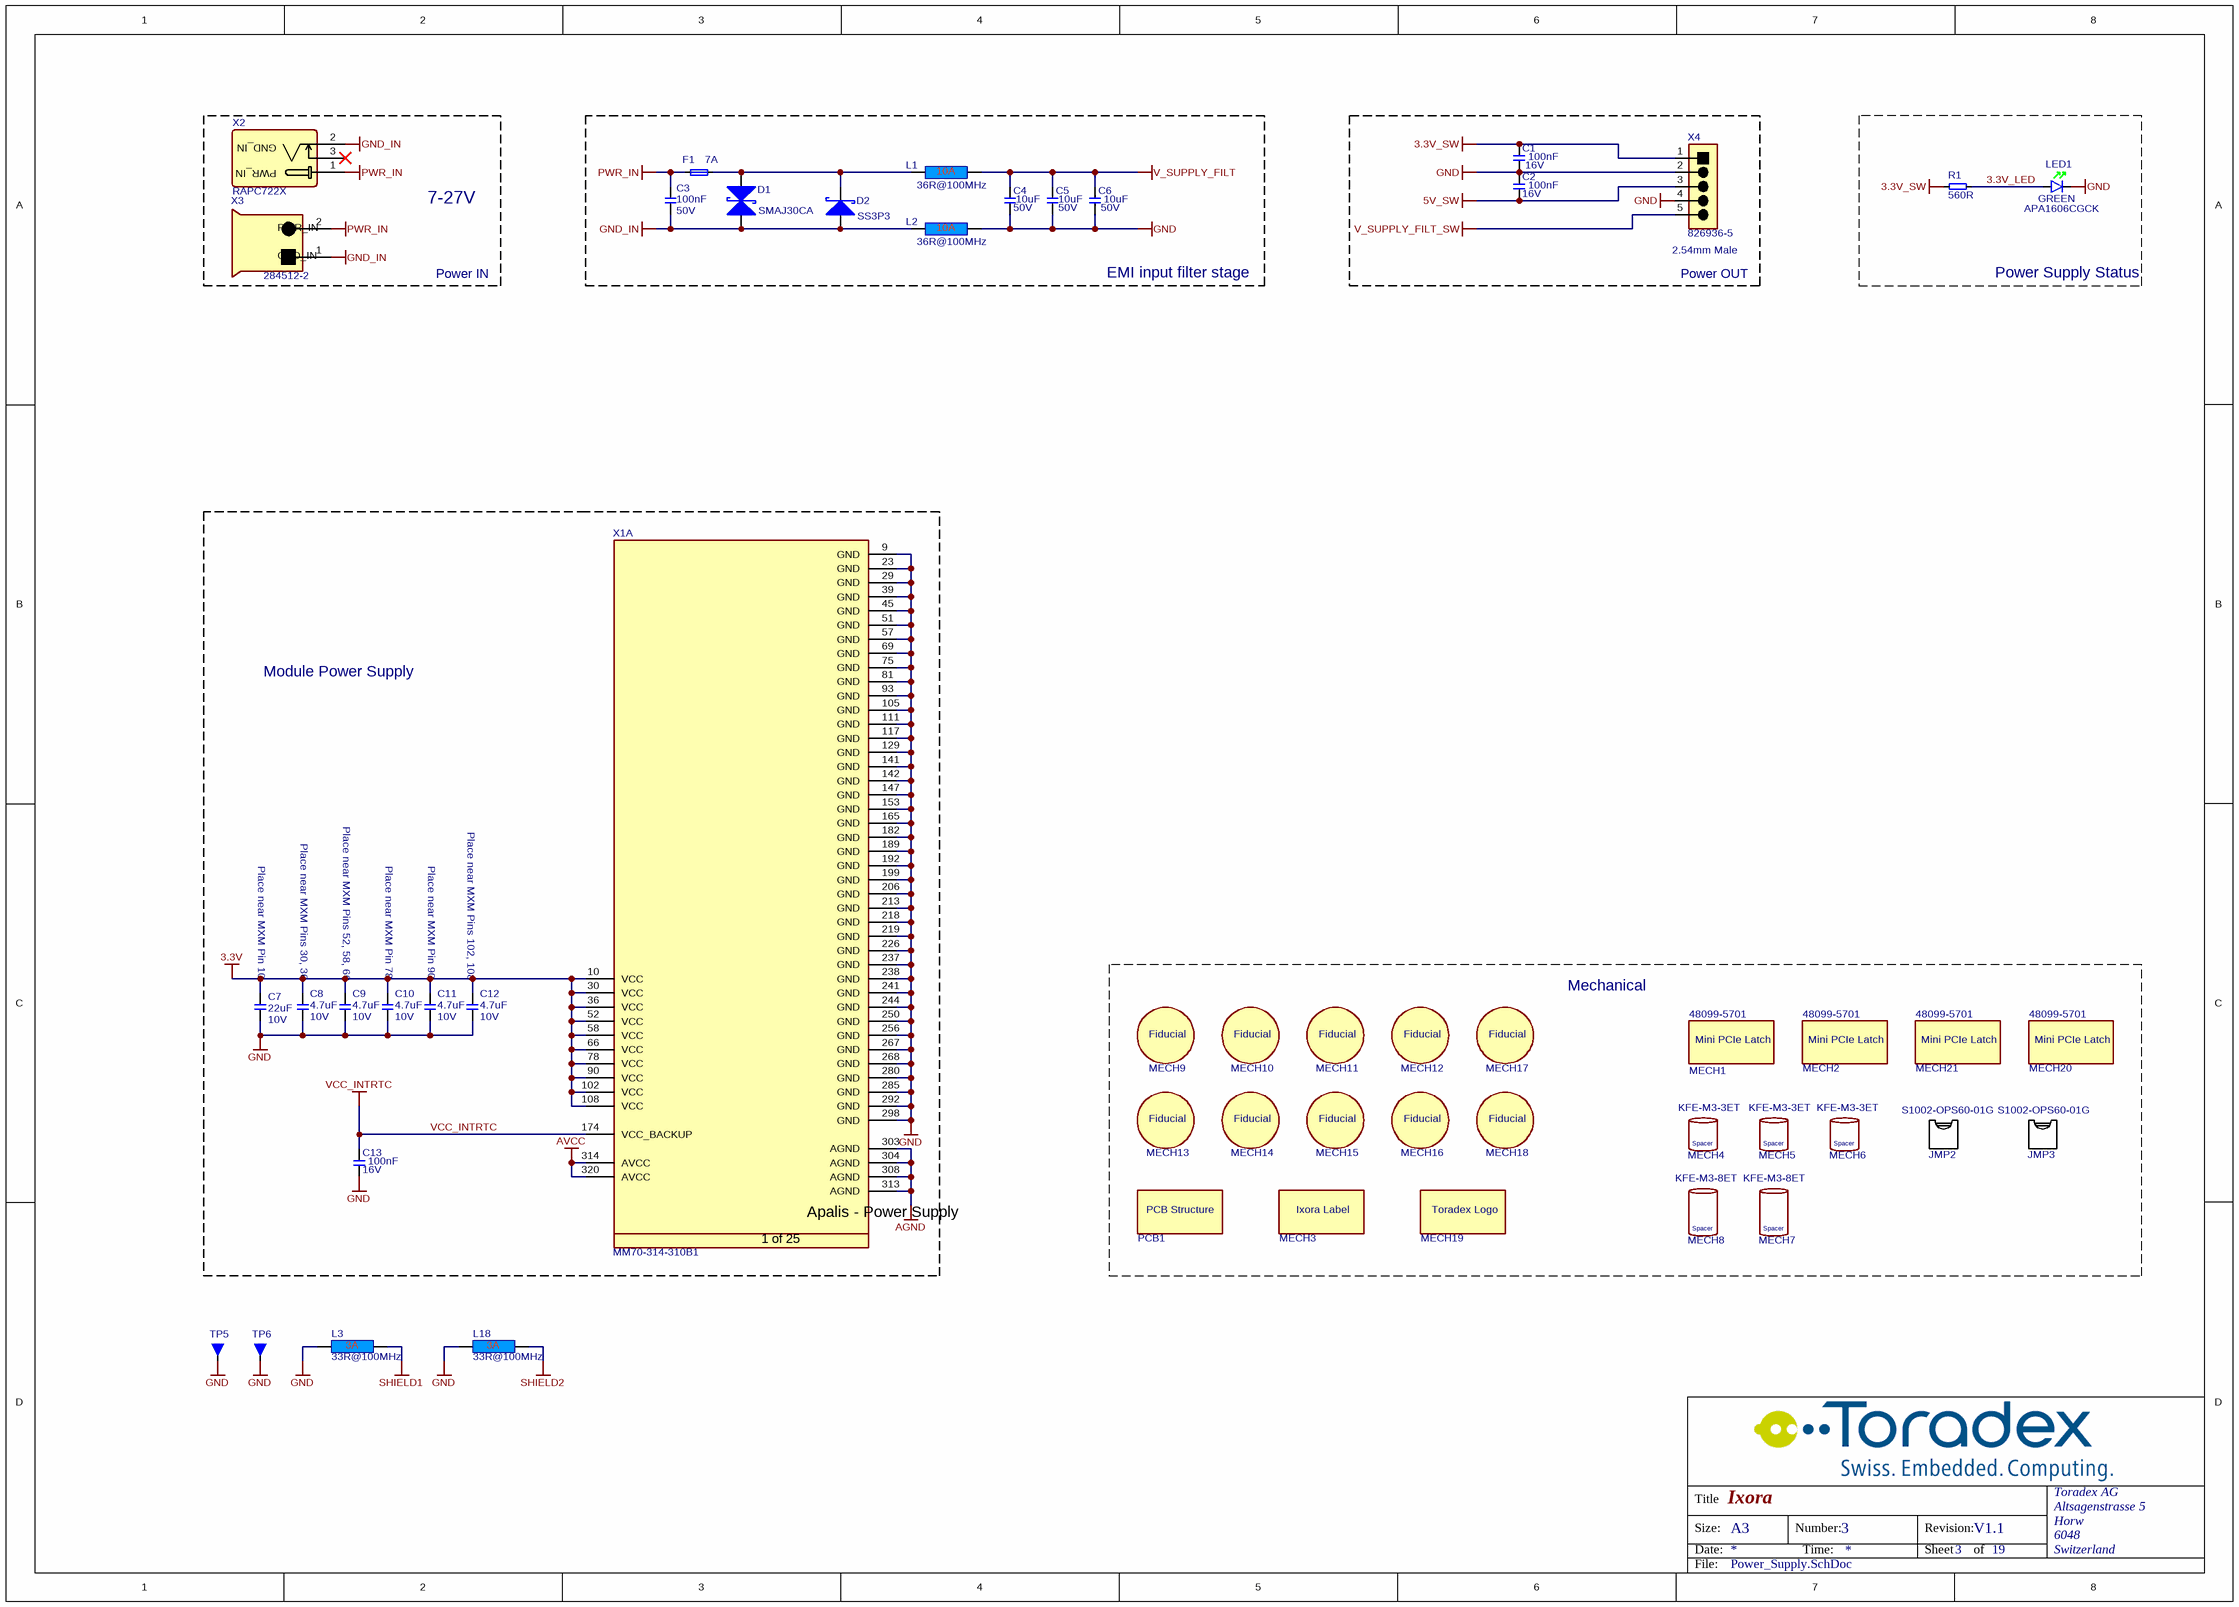
[diagram p5: Power_Supply.SchDoc]

### Parts
C1  Rating: 16V  [CAPC1005X60N]  (hidden comment: 100nF)
C2  Rating: 16V  [CAPC1005X60N]  (hidden comment: 100nF)
C3  Rating: 50V  [T_CAPC0603X33N]  (hidden comment: 100nF)
C4  Rating: 50V  [CAPC3225X160N]  (hidden comment: 10uF)
C5  Rating: 50V  [CAPC3225X160N]  (hidden comment: 10uF)
C6  Rating: 50V  [CAPC3225X160N]  (hidden comment: 10uF)
C7  Rating: 10V  [T_CAPC0805X125N]  (hidden comment: 22uF)
C8  Rating: 10V  [T_CAPC0603X33N]  (hidden comment: 4.7uF)
C9  Rating: 10V  [T_CAPC0603X33N]  (hidden comment: 4.7uF)
C10  Rating: 10V  [T_CAPC0603X33N]  (hidden comment: 4.7uF)
C11  Rating: 10V  [T_CAPC0603X33N]  (hidden comment: 4.7uF)
C12  Rating: 10V  [T_CAPC0603X33N]  (hidden comment: 4.7uF)
C13  Rating: 16V  [CAPC1005X60N]  (hidden comment: 100nF)
D1  Manufacturer Part No.: SMAJ30CA  [T_LITTLEFUSE_SMAJ30CA]  (hidden comment: D-Littelfuse-SMAJ30CA-Schottky)
D2  SS3P3  [T_VISHAY_SS3P3]
F1  7A  [T_Littelfuse_0458]
JMP2  Manufacturer Part No.: S1002-OPS60-01G  (hidden comment: Shunt Jumper)  (mechanical)
JMP3  Manufacturer Part No.: S1002-OPS60-01G  (hidden comment: Shunt Jumper)  (mechanical)
L1  36R@100MHz  [T_Laird_35F0121-0SR-10]
L2  36R@100MHz  [T_Laird_35F0121-0SR-10]
L3  33R@100MHz  [INDC1608X95N]
L18  33R@100MHz  [INDC1608X95N]
LED1  Color: GREEN  [T_Kingbright_APA1606CGCK]  (hidden comment: APA1606CGCK)
MECH1  Manufacturer Part No.: 48099-5701  [T_Molex_48099-5701]  (hidden comment: MECH-Mini-PCIe Latch)
MECH2  Manufacturer Part No.: 48099-5701  [T_Molex_48099-5701]  (hidden comment: MECH-Mini-PCIe Latch)
MECH3  IxoraV1.1.001-Label  (value not drawn)  (no BOM)
MECH4  KFE-M3-3ET  (mechanical)
MECH5  KFE-M3-3ET  (mechanical)
MECH6  KFE-M3-3ET  (mechanical)
MECH7  KFE-M3-8ET  (mechanical)
MECH8  KFE-M3-8ET  (mechanical)
MECH9  MECH-Fiducial  [T_Fiducial]  (value not drawn)  (no BOM)
MECH10  MECH-Fiducial  [T_Fiducial]  (value not drawn)  (no BOM)
MECH11  MECH-Fiducial  [T_Fiducial]  (value not drawn)  (no BOM)
MECH12  MECH-Fiducial  [T_Fiducial]  (value not drawn)  (no BOM)
MECH13  MECH-Fiducial  [T_Fiducial]  (value not drawn)  (no BOM)
MECH14  MECH-Fiducial  [T_Fiducial]  (value not drawn)  (no BOM)
MECH15  MECH-Fiducial  [T_Fiducial]  (value not drawn)  (no BOM)
MECH16  MECH-Fiducial  [T_Fiducial]  (value not drawn)  (no BOM)
MECH17  MECH-Fiducial  [T_Fiducial]  (value not drawn)  (no BOM)
MECH18  MECH-Fiducial  [T_Fiducial]  (value not drawn)  (no BOM)
MECH19  MECH-Toradex_Logo  [T_TORADEX_LOGO]  (value not drawn)  (no BOM)
MECH20  Manufacturer Part No.: 48099-5701  (hidden comment: MECH-Mini-PCIe Latch)
MECH21  Manufacturer Part No.: 48099-5701  (hidden comment: MECH-Mini-PCIe Latch)
PCB1  PCB-IxoraV1.1.001  (value not drawn)
R1  560R  [RESC1005X40N]
TP5  5011  [T_TP-THT - EYE]  (value not drawn)
TP6  5011  [T_TP-THT - EYE]  (value not drawn)
X1  Manufacturer Part No.: MM70-314-310B1  [T_JAE_MM70-314-310B1]  (hidden comment: CON-JAE-MM70-314-310B1-314-0.5mm)  (part A of 25)
X2  RAPC722X  [T_RAPC722X]
X3  284512-2  [T_TYCO_284512-2]
X4  826936-5  [T_TYCO_826936-5]

### Blocks framed on the sheet
7-27V: X2 X3
EMI input filter stage: C3-C6 D1 D2 F1 L1 L2
Power OUT: C1 C2 X4
Power Supply Status: LED1 R1
Module Power Supply: C7-C13 X1
Mechanical: JMP2 JMP3 MECH1-MECH21 PCB1

### Nets
3.3V: C7.1 C8.1 C9.1 C10.1 C11.1 C12.1 X1.10(VCC) X1.30(VCC) X1.36(VCC) X1.52(VCC) X1.58(VCC) X1.66(VCC) X1.78(VCC) X1.90(VCC) X1.102(VCC) X1.108(VCC)
3.3V_SW: C1.2 R1.1 X4.1
5V_SW: C2.1 X4.3
AGND: X1.303(AGND) X1.304(AGND) X1.308(AGND) X1.313(AGND)
AVCC: X1.314(AVCC) X1.320(AVCC)
GND: C1.1 C2.2 C4.1 C5.1 C6.1 C7.2 C8.2 C9.2 C10.2 C11.2 C12.2 C13.1 L2.2 L3.1 L18.1 LED1.1(K) TP5.1 TP6.1 X1.9(GND) X1.23(GND) X1.29(GND) X1.39(GND) X1.45(GND) X1.51(GND) X1.57(GND) X1.69(GND) X1.75(GND) X1.81(GND) X1.93(GND) X1.105(GND) X1.111(GND) X1.117(GND) X1.129(GND) X1.141(GND) X1.142(GND) X1.147(GND) X1.153(GND) X1.165(GND) X1.182(GND) X1.189(GND) X1.192(GND) X1.199(GND) X1.206(GND) X1.213(GND) X1.218(GND) X1.219(GND) X1.226(GND) X1.237(GND) X1.238(GND) X1.241(GND) X1.244(GND) X1.250(GND) X1.256(GND) X1.267(GND) X1.268(GND) X1.280(GND) X1.285(GND) X1.292(GND) X1.298(GND) X4.2 X4.4
GND_IN: C3.1 D1.2(Anode) D2.2 L2.1 X2.2(PWR_IN) X3.1(GND_IN)
PWR_IN: C3.2 F1.1 X2.1(GND_IN) X3.2(PWR_IN)
SHIELD1: L3.2
SHIELD2: L18.2
V_SUPPLY_FILT: C4.2 C5.2 C6.2 L1.2
V_SUPPLY_FILT_SW: X4.5
VCC_INTRTC: C13.2 X1.174(VCC_BACKUP)
3.3V_LED: LED1.2(A) R1.2
NetD1_1: D1.1(Cathode) D2.1 F1.2 L1.1

Not connected (* = marked no-connect by the designer): X2 3(PWR_IN)*

### Notes on the sheet
- (near X4) 2.54mm Male
- Power IN
- (near C8) Place near MXM Pins 30, 36
- (near C9) Place near MXM Pins 52, 58, 66
- Place near MXM Pins 102, 108
- Place near MXM Pin 10
- Place near MXM Pin 78
- Place near MXM Pin 90
- Title
- Size:
- Date:
- A3
- Number:
- Time:
- Revision:
- Sheet
- of
- File:
- (in symbol CON-JAE-MM70-314-310B1-314-0.5mm, part A) Apalis - Power Supply; 1 of 25
- (in symbol MECH-HiTech-KFE-M3-3ET) Spacer
- (in symbol MECH-HiTech-KFE-M3-8ET) Spacer
- (in symbol MECH-IxoraV1.1.001-Label) Ixora Label
- (in symbol MECH-Molex-48099-5701) Mini PCIe Latch
- (in symbol MECH-Toradex_Logo) Toradex Logo

### Library data of the parts
C1 C2 C13 = C-X7R-100nF-16V-10%-0402: Capacitor Ceramic X7R 100nF 16V 10% 0402; Tolerance: 10%; Type: X7R; Value: 100nF
C3 = C-X7R-100nF-50V-20%-0603: Capacitor Ceramic X7R 100nF 50V 20% 0603; Tolerance: 20%; Type: X7R; Value: 100nF
C4-C6 = C-X5R-10uF-50V-20%-1210: Capacitor Ceramic X5R 10uF 50V 20% 1210; Tolerance: 20%; Type: X5R; Value: 10uF
C7 = C-X5R-22uF-10V-20%-0805: Capacitor Ceramic X5R 22uF 10V 20% 0805; Tolerance: 20%; Type: X5R; Value: 22uF
C8-C12 = C-X5R-4.7uF-10V-10%-0603: Capacitor Ceramic X5R 4.7uF 10V 10% 0603; Tolerance: 10%; Type: X5R; Value: 4.7uF
D1 = D-Littelfuse-SMAJ30CA-Schottky: Bidirectional ESD protection; Manufacturer Name: Littelfuse
D2 = D-Vishay-SS3P3-E3/84A-Schottky: SS3P3-E3/84A Schottky Diode; Manufacturer Name: Vishay; Manufacturer Part No.: SS3P3-E3/84A
F1 = F-Littelfuse-0458007: Fuse 7A Fast; Manufacturer Part No.: 0458007; Manufacturer Name: Littelfuse; Value: 7A
JMP2 JMP3 = MECH-Shunt-Jumper-Black-2.54mm: Manufacturer Name: JVE
L1 L2 = L-Laird-35F0121-0SR-10-10A-25%: Power Supply FB 10A; Tolerance: 25%; Rating: 10A; Value: 36R@100MHz
L3 L18 = L-33R@100MHz-3A-25%-0603: 33R@100MHz 3A EMI FILTER; Tolerance: 25%; Rating: 3A; Value: 33R@100MHz
LED1 = LED-Kingbright-APA1606CGCK: LED green Kingbright APA1606CGCK; Manufacturer Name: Kingbright; Manufacturer Part No.: APA1606CGCK
MECH1 MECH2 MECH20 MECH21 = MECH-Molex-48099-5701: Mini-PCIe Latch; Manufacturer Name: Molex
MECH3 = MECH-IxoraV1.1.001-Label
MECH4-MECH6 = MECH-HiTech-KFE-M3-3ET: Spacer 3mm M3; Manufacturer Name: Hi-Tech Fasteners Inc; Manufacturer Part No.: KFE-M3-3ET
MECH7 MECH8 = MECH-HiTech-KFE-M3-8ET: Spacer 8mm M3; Manufacturer Name: Hi-Tech Fasteners Inc; Manufacturer Part No.: KFE-M3-8ET
MECH9-MECH18 = MECH-Fiducial: Fiducial
MECH19 = MECH-Toradex_Logo: Toradex_Logo
PCB1 = PCB-IxoraV1.1.001: PCB Structure
R1 = R-560R-63mW-5%-0402: Resistor 560 ohm 63mW 5% 0402; Rating: 63mW; Tolerance: 5%; Value: 560R
TP5 TP6 = TP-Keystone-5011: Testpin Eye TH; Manufacturere Name: Keystone; Manufacturere Part No.: 5011
X1 = CON-JAE-MM70-314-310B1-314-0.5mm: as X1 on sheet Audio
X2 = CON-SWC-RAPC722X: Power Jack; Manufacturer Name: SWC; Manufacturer Part No.: RAPC722X
X3 = CON-Tyco-284512-2-1x2-3.5mm: Power Connector; Manufacturer Name: Tyco; No. of ways: 1x2; Pitch: 3.5mm; Manufacturer Part No.: 284512-2
X4 = CON-Tyco-826936-5-1X5-2.54mm: Header, 5-Pin; Manufacturer Name: Tyco; No. of ways: 1X5; Pitch: 2.54mm; Manufacturer Part No.: 826936-5

## Sheet Power_Switch.SchDoc: Ixora
size A3; Organization: Toradex AG; Address1: Altsagenstrasse 5; Address2: Horw; Address3: 6048; Address4: Switzerland; DocumentNumber: 4; Revision: V1.1; SheetNumber: 4; SheetTotal: 19; PageSetup: Record=PageOptions|CenterHorizontal=True|CenterVertical=True|PrintScale=0.71|XCorrection=1.00|YCorrection=1.00|PrintKind=0|BorderSize=5000000|LeftOffset=0|BottomOffset=0|Orientation=2|PaperLength=1000|PaperWidth=1000|Scale=100|PaperSource=7|PrintQuality=-4|MediaType=1|DitherType=10|PaperKind=A4|PrintScaleMode=1
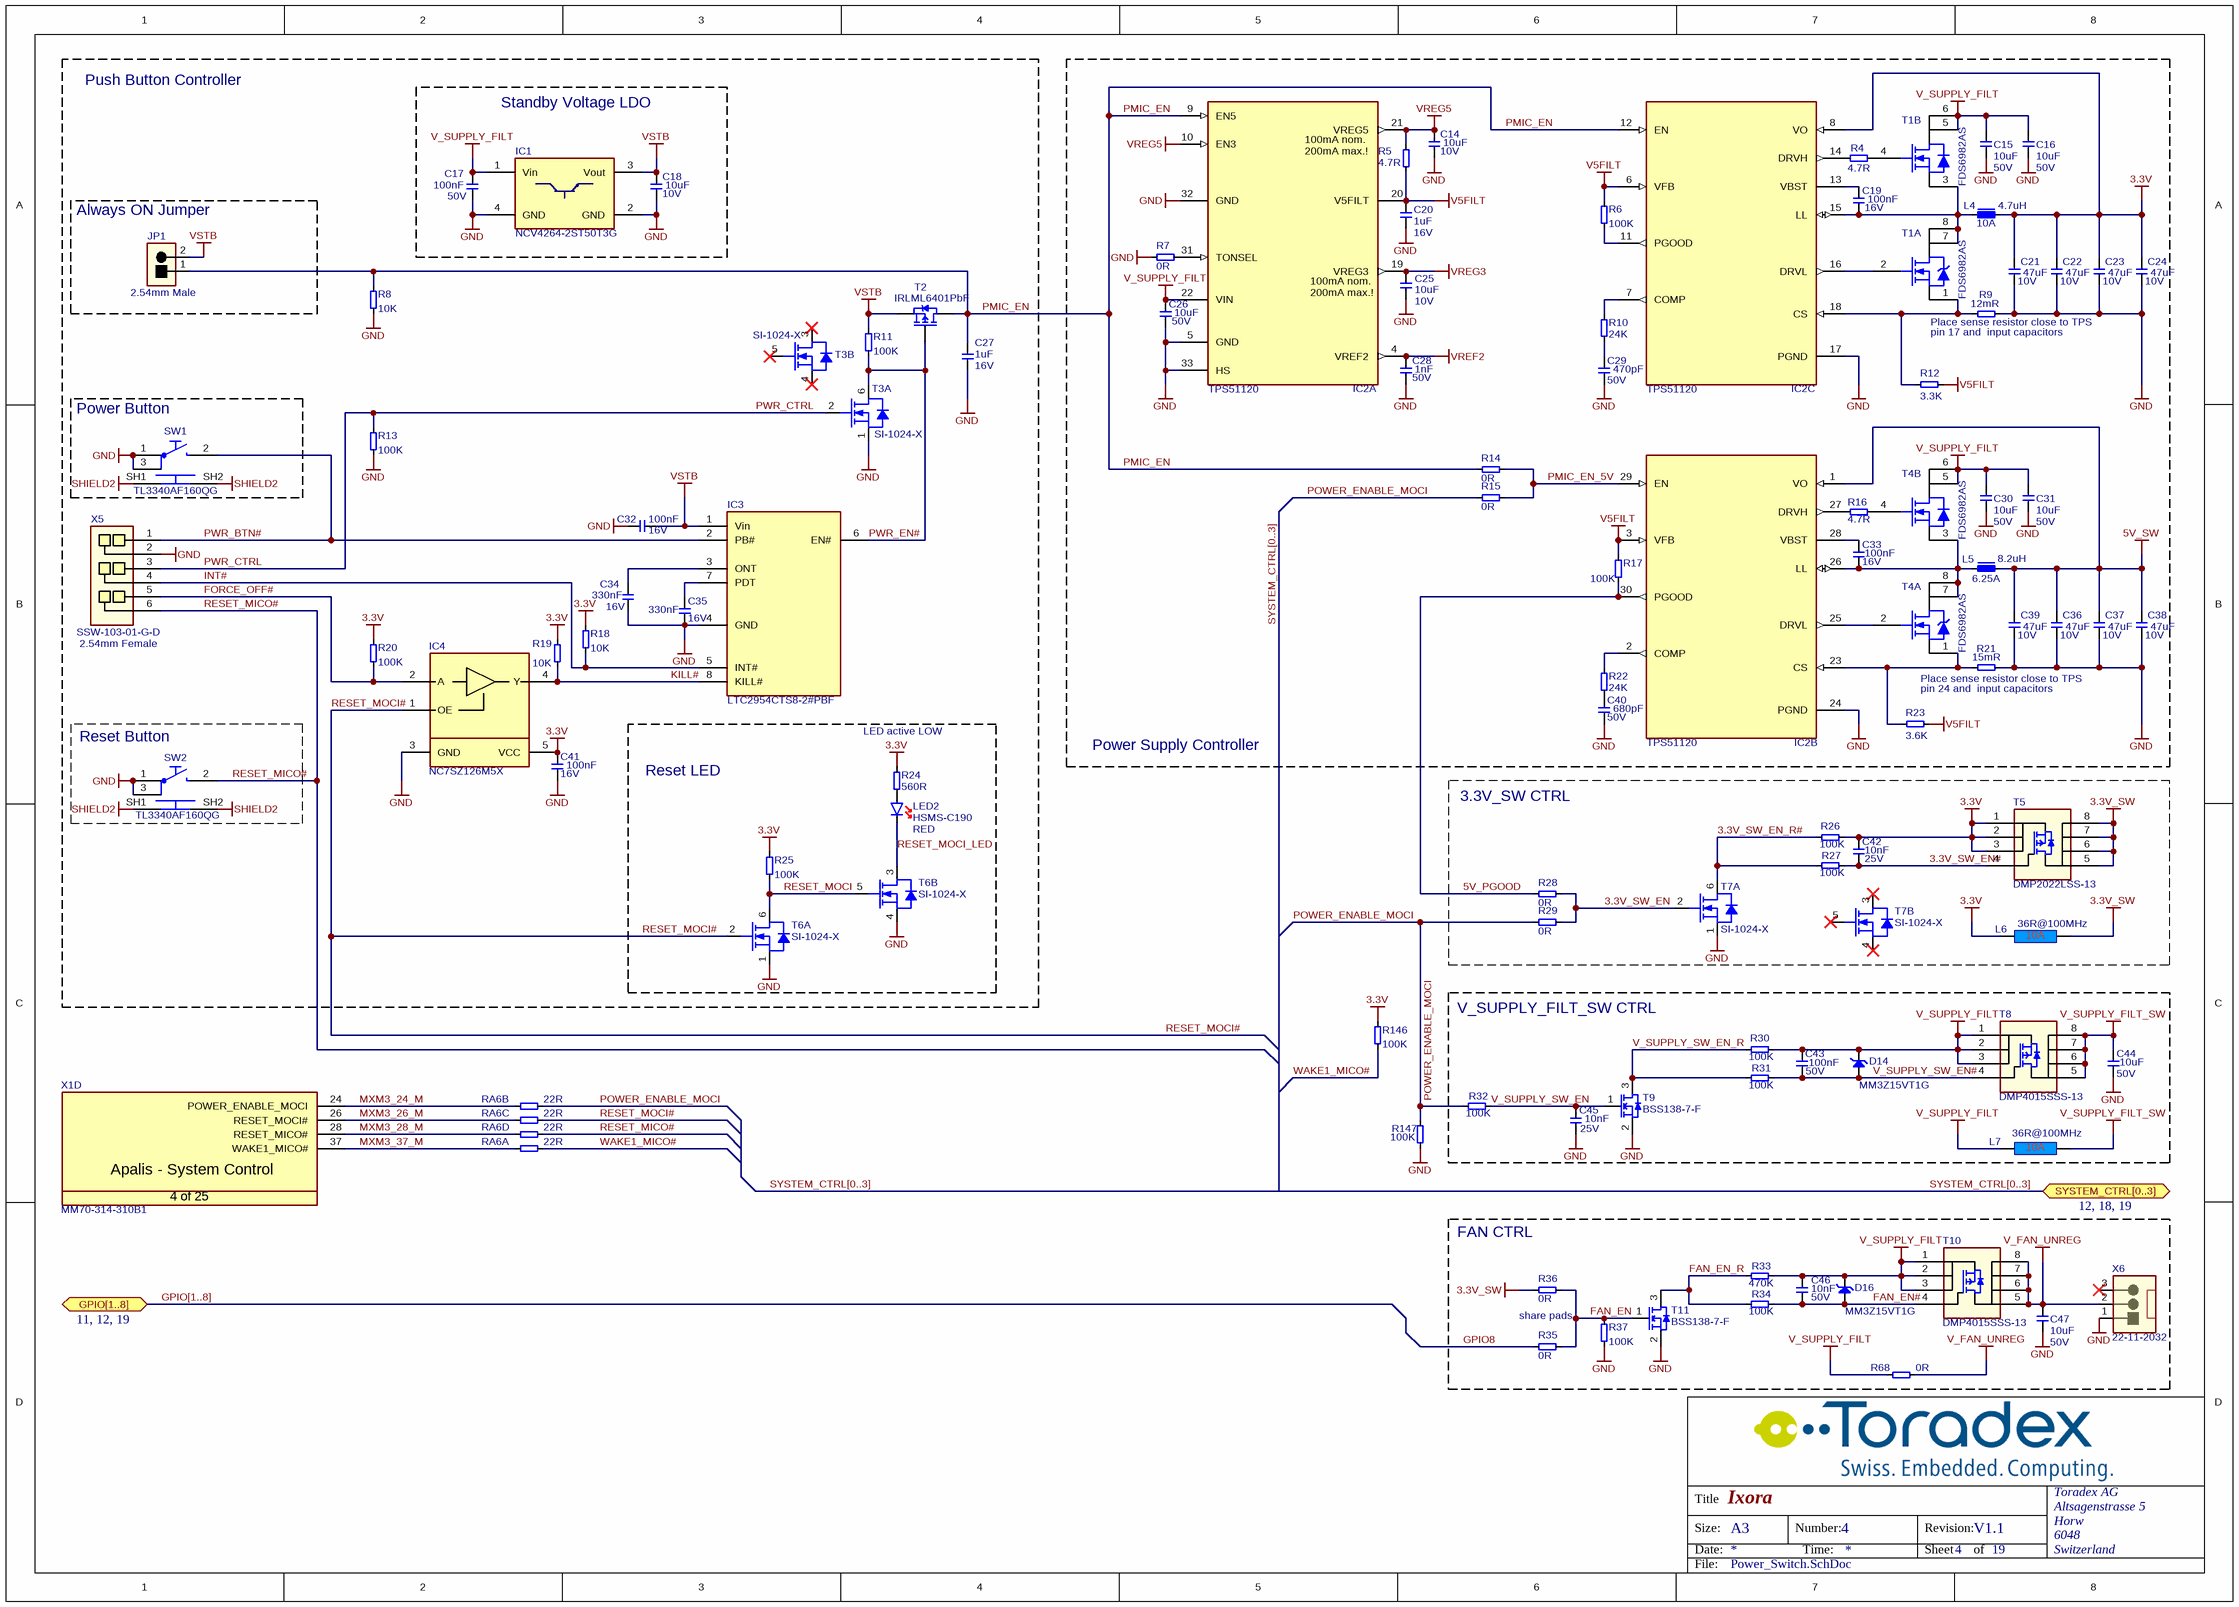
[diagram p6: Power_Switch.SchDoc]

### Parts
C14  Rating: 10V  [T_CAPC0603X33N]  (hidden comment: 10uF)
C15  Rating: 50V  [CAPC3225X160N]  (hidden comment: 10uF)
C16  Rating: 50V  [CAPC3225X160N]  (hidden comment: 10uF)
C17  Rating: 50V  [T_CAPC0603X33N]  (hidden comment: 100nF)
C18  Rating: 10V  [T_CAPC0603X33N]  (hidden comment: 10uF)
C19  Rating: 16V  [CAPC1005X60N]  (hidden comment: 100nF)
C20  Rating: 16V  [T_CAPC0603X33N]  (hidden comment: 1uF)
C21  Rating: 10V  [T_CAPC0805X125N]  (hidden comment: 47uF)
C22  Rating: 10V  [T_CAPC0805X125N]  (hidden comment: 47uF)
C23  Rating: 10V  [T_CAPC0805X125N]  (hidden comment: 47uF)
C24  Rating: 10V  [T_CAPC0805X125N]  (hidden comment: 47uF)
C25  Rating: 10V  [T_CAPC0603X33N]  (hidden comment: 10uF)
C26  Rating: 50V  [CAPC3225X160N]  (hidden comment: 10uF)
C27  Rating: 16V  [T_CAPC0603X33N]  (hidden comment: 1uF)
C28  Rating: 50V  [CAPC1005X60N]  (hidden comment: 1nF)
C29  Rating: 50V  [CAPC1005X60N]  (hidden comment: 470pF)
C30  Rating: 50V  [CAPC3225X160N]  (hidden comment: 10uF)
C31  Rating: 50V  [CAPC3225X160N]  (hidden comment: 10uF)
C32  Rating: 16V  [CAPC1005X60N]  (hidden comment: 100nF)
C33  Rating: 16V  [CAPC1005X60N]  (hidden comment: 100nF)
C34  Rating: 16V  [T_CAPC0805X125N]  (hidden comment: 330nF)
C35  Rating: 16V  [T_CAPC0805X125N]  (hidden comment: 330nF)
C36  Rating: 10V  [T_CAPC0805X125N]  (hidden comment: 47uF)
C37  Rating: 10V  [T_CAPC0805X125N]  (hidden comment: 47uF)
C38  Rating: 10V  [T_CAPC0805X125N]  (hidden comment: 47uF)
C39  Rating: 10V  [T_CAPC0805X125N]  (hidden comment: 47uF)
C40  Rating: 50V  [CAPC1005X60N]  (hidden comment: 680pF)
C41  Rating: 16V  [CAPC1005X60N]  (hidden comment: 100nF)
C42  Rating: 25V  [CAPC1005X60N]  (hidden comment: 10nF)
C43  Rating: 50V  [T_CAPC0603X33N]  (hidden comment: 100nF)
C44  Rating: 50V  [CAPC3225X160N]  (hidden comment: 10uF)
C45  Rating: 25V  [CAPC1005X60N]  (hidden comment: 10nF)
C46  Rating: 50V  [CAPC1005X60N]  (hidden comment: 10nF)
C47  Rating: 50V  [CAPC3225X160N]  (hidden comment: 10uF)
D14  MM3Z15VT1G  [T_SOD-323]
D16  MM3Z15VT1G  [T_SOD-323]
IC1  NCV4264-2ST50T3G  [T_ON_NCV4264-2ST50T3G]
IC2  TPS51120  [QFN50P500X500X100-33N]  (parts A,B,C of 3)
IC3  LTC2954CTS8-2#PBF  [T_LINEAR_LTC2954CTS8-2#PBF]
IC4  NC7SZ126M5X  [SOT95P279X142-5N]
JP1  TSW-101-07-G-D  [T_Samtec_TSW-101-07-G-D]  (value not drawn)
L4  Rating: 10A  [T_INDM110100]  (hidden comment: 4.7uH)
L5  Rating: 6.25A  [T_INDM120120X80N]  (hidden comment: 8.2uH)
L6  36R@100MHz  [T_Laird_35F0121-0SR-10]
L7  36R@100MHz  [T_Laird_35F0121-0SR-10]
LED2  Manufacturer Part No.: HSMS-C190  Color: RED  [LEDC1608X80N_R]  (hidden comment: LED)
R4  4.7R  [RESC1005X40N]
R5  4.7R  [RESC1005X40N]
R6  100K  [RESC1005X40N]
R7  0R  [RESC1005X40N]
R8  10K  [RESC1005X40N]
R9  12mR  [RESC3316X76N]
R10  24K  [RESC1005X40N]
R11  100K  [RESC1005X40N]
R12  3.3K  [RESC1005X40N]
R13  100K  [RESC1005X40N]
R14  0R  [T_RESC0603X30N]
R15  0R  [T_RESC0603X30N]
R16  4.7R  [RESC1005X40N]
R17  100K  [RESC1005X40N]
R18  10K  [RESC1005X40N]
R19  10K  [RESC1005X40N]
R20  100K  [RESC1005X40N]
R21  15mR  [RESC3316X76N]
R22  24K  [RESC1005X40N]
R23  3.6K  [RESC1005X40N]
R24  560R  [RESC1005X40N]
R25  100K  [RESC1005X40N]
R26  100K  [RESC1005X40N]
R27  100K  [RESC1005X40N]
R28  0R  [T_RESC0603X30N]
R29  0R  [T_RESC0603X30N]
R30  100K  [RESC1005X40N]
R31  100K  [RESC1005X40N]
R32  100K  [RESC1005X40N]
R33  470K  [RESC1005X40N]
R34  100K  [RESC1005X40N]
R35  0R  [T_RESC0603X30N]
R36  0R  [T_RESC0603X30N]
R37  100K  [RESC1005X40N]
R68  0R  [T_RESC3225X30N]
R146  100K  [RESC1005X40N]
R147  100K  [RESC1005X40N]
RA6  22R  [T_Resistor_Array_X4]  (parts A,B,C,D of 4)
SW1  TL3340AF160QG  [T_E-SWITCH- TL3340AF160QG]
SW2  TL3340AF160QG  [T_E-SWITCH- TL3340AF160QG]
T1  FDS6982AS  [SOIC127P600X173-8N]  (parts A,B of 2)
T2  IRLML6401PbF  [SOT95P237X112-3N]
T3  Manufacturer Part No.: SI-1024-X  [SOTFL50P160X60-6N]  (hidden comment: T-Vishay-SI-1024X-N)  (parts A,B of 2)
T4  FDS6982AS  [SOIC127P600X173-8N]  (parts A,B of 2)
T5  DMP2022LSS-13  [SOIC127P600X173-8N]
T6  Manufacturer Part No.: SI-1024-X  [SOTFL50P160X60-6N]  (hidden comment: T-Vishay-SI-1024X-N)  (parts A,B of 2)
T7  Manufacturer Part No.: SI-1024-X  [SOTFL50P160X60-6N]  (hidden comment: T-Vishay-SI-1024X-N)  (parts A,B of 2)
T8  DMP4015SSS-13  [SOIC127P600X173-8N]
T9  BSS138-7-F  [SOT95P237X112-3N]
T10  DMP4015SSS-13  [SOIC127P600X173-8N]
T11  BSS138-7-F  [SOT95P237X112-3N]
X1  Manufacturer Part No.: MM70-314-310B1  [T_JAE_MM70-314-310B1]  (hidden comment: CON-JAE-MM70-314-310B1-314-0.5mm)  (part D of 25)
X5  Manufacturer Part No.: SSW-103-01-G-D  [T_Samtec_SSW-103-01-G-D]  (hidden comment: TSW-103-01-G-D)
X6  22-11-2032  [T_MOLEX_22-11-2032]

### Blocks framed on the sheet
Push Button Controller: C27 C32 C34 C35 C41 IC3 IC4 R8 R11 R13 R18-R20 T2 T3 X5
Power Supply Controller: C14-C16 C19-C26 C28-C31 C33 C36-C40 IC2 L4 L5 R4-R7 R9 R10 R12 R14-R17 R21-R23 T1 T4
Standby Voltage LDO: C17 C18 IC1
Always ON Jumper: JP1
Power Button: SW1
Reset Button: SW2
Reset LED: LED2 R24 R25 T6
3.3V_SW CTRL: C42 L6 R26-R29 T5 T7
V_SUPPLY_FILT_SW CTRL: C43-C45 D14 L7 R30-R32 T8 T9
FAN CTRL: C46 C47 D16 R33-R37 R68 T10 T11 X6

### Ports
GPIO[1..8] (bidir, see 11, 12, 19), SYSTEM_CTRL[0..3] (bidir, see 12, 18, 19)

### Nets
3.3V: C21.2 C22.2 C23.2 C24.2 C41.1 C42.2 IC2.8(VO) IC4.5(VCC) L4.2 L6.1 R18.1 R19.1 R20.2 R24.1 R25.2 R26.1 R146.2 T5.1(S) T5.2(S) T5.3(S)
3.3V_SW: L6.2 R36.1 T5.5(D) T5.6(D) T5.7(D) T5.8(D)
5V_SW: C36.2 C37.2 C38.2 C39.2 IC2.1(VO) L5.2
GND: C14.1 C15.1 C16.1 C17.1 C18.1 C20.1 C21.1 C22.1 C23.1 C24.1 C25.1 C26.1 C27.1 C28.1 C29.1 C30.1 C31.1 C32.1 C34.1 C35.1 C36.1 C37.1 C38.1 C39.1 C40.1 C41.2 C44.1 C45.1 C47.1 IC1.2(GND) IC1.4(GND) IC2.5(GND) IC2.17(PGND) IC2.24(PGND) IC2.32(GND) IC2.33(HS) IC3.4(GND) IC4.3(GND) R7.1 R8.1 R9.2 R13.1 R21.2 R37.2 R147.1 SW1.1 SW1.3 SW2.1 SW2.3 T3.1(S) T6.1(S) T6.4(S) T7.1(S) T9.2 T11.2 X5.2 X6.1
SHIELD2: SW1.SH1 SW1.SH2 SW2.SH1 SW2.SH2
V5FILT: C20.2 IC2.3(VFB) IC2.6(VFB) IC2.20(V5FILT) R5.1 R6.2 R12.2 R17.2 R23.2
V_FAN_UNREG: C47.2 R68.2 T10.5(D) T10.6(D) T10.7(D) T10.8(D) X6.2
V_SUPPLY_FILT: C15.2 C16.2 C17.2 C26.2 C30.2 C31.2 C43.2 C46.2 D14.1(C) D16.1(C) IC1.1(Vin) IC2.22(VIN) L7.1 R30.2 R33.2 R68.1 T1.5(D) T1.6(D) T4.5(D) T4.6(D) T8.1(S) T8.2(S) T8.3(S) T10.1(S) T10.2(S) T10.3(S)
V_SUPPLY_FILT_SW: C44.2 L7.2 T8.5(D) T8.6(D) T8.7(D) T8.8(D)
VREF2: C28.2 IC2.4(VREF2)
VREG3: C25.2 IC2.19(VREG3)
VREG5: C14.2 IC2.10(EN3) IC2.21(VREG5) R5.2
VSTB: C18.2 C32.2 IC1.3(Vout) IC3.1(Vin) JP1.2 R11.2 T2.2
3.3V_SW_EN: R28.1 R29.2 T7.2(G)
3.3V_SW_EN#: C42.1 R27.1 T5.4(G)
3.3V_SW_EN_R#: R26.2 R27.2 T7.6(D)
5V_PGOOD: IC2.30(PGOOD) R17.1 R28.2
FAN_EN: R35.1 R36.2 R37.1 T11.1
FAN_EN#: C46.1 D16.2(A) R34.2 T10.4(G)
FAN_EN_R: R33.1 R34.1 T11.3
FORCE_OFF#: IC4.2(A) R20.1 X5.5
GPIO8: R35.2
INT#: IC3.5(INT#) R18.2 X5.4
KILL#: IC3.8(KILL#) IC4.4(Y) R19.2
MXM3_24_M: RA6.2 X1.24(POWER_ENABLE_MOCI)
MXM3_26_M: RA6.3 X1.26(RESET_MOCI#)
MXM3_28_M: RA6.4 X1.28(RESET_MICO#)
MXM3_37_M: RA6.1 X1.37(WAKE1_MICO#)
PMIC_EN: C27.2 IC2.9(EN5) IC2.12(EN) JP1.1 R8.2 R14.1 T2.3
PMIC_EN_5V: IC2.29(EN) R14.2 R15.2
POWER_ENABLE_MOCI: R15.1 R29.1 R32.1 R147.2 RA6.6
PWR_BTN#: IC3.2(PB#) SW1.2 X5.1
PWR_CTRL: R13.2 T3.2(G) X5.3
PWR_EN#: IC3.6(EN#) R11.1 T2.1 T3.6(D)
RESET_MICO#: RA6.8 SW2.2 X5.6
RESET_MOCI: R25.1 T6.5(G) T6.6(D)
RESET_MOCI#: IC4.1(OE) RA6.7 T6.2(G)
RESET_MOCI_LED: LED2.1(K) T6.3(D)
V_SUPPLY_SW_EN: C45.2 R32.2 T9.1
V_SUPPLY_SW_EN#: C43.1 D14.2(A) R31.2 T8.4(G)
V_SUPPLY_SW_EN_R: R30.1 R31.1 T9.3
WAKE1_MICO#: R146.1 RA6.5
NetC19_1: C19.1 IC2.15(LL) L4.1 T1.3(S) T1.7(D) T1.8(D)
NetC19_2: C19.2 IC2.13(VBST)
NetC29_2: C29.2 R10.1
NetC33_1: C33.1 IC2.26(LL) L5.1 T4.3(S) T4.7(D) T4.8(D)
NetC33_2: C33.2 IC2.28(VBST)
NetC34_2: C34.2 IC3.3(ONT)
NetC35_2: C35.2 IC3.7(PDT)
NetC40_2: C40.2 R22.1
NetIC2_2: IC2.2(COMP) R22.2
NetIC2_7: IC2.7(COMP) R10.2
NetIC2_11: IC2.11(PGOOD) R6.1
NetIC2_14: IC2.14(DRVH) R4.1
NetIC2_16: IC2.16(DRVL) T1.2(G)
NetIC2_18: IC2.18(CS) R9.1 R12.1 T1.1(S)
NetIC2_23: IC2.23(CS) R21.1 R23.1 T4.1(S)
NetIC2_25: IC2.25(DRVL) T4.2(G)
NetIC2_27: IC2.27(DRVH) R16.1
NetIC2_31: IC2.31(TONSEL) R7.2
NetLED2_2: LED2.2(A) R24.2
NetR4_2: R4.2 T1.4(G)
NetR16_2: R16.2 T4.4(G)

Not connected (* = marked no-connect by the designer): T3 3(D)* 4(S)* 5(G)*; T7 3(D)* 4(S)* 5(G)*; X6 3*

### Buses and harness runs
bus GPIO[1..8] = port GPIO[1..8]
bus SYSTEM_CTRL[0..3] = port SYSTEM_CTRL[0..3]

### Notes on the sheet
- (near JP1) 2.54mm Male
- (near R9) Place sense resistor close to TPS
- (near R9) pin 17 and  input capacitors
- (near X5) 2.54mm Female
- (near R21) Place sense resistor close to TPS
- pin 24 and  input capacitors
- LED active LOW
- share pads
- Title
- Size:
- Date:
- A3
- Number:
- Time:
- Revision:
- Sheet
- of
- File:
- (in symbol CON-JAE-MM70-314-310B1-314-0.5mm, part D) Apalis - System Control; 4 of 25
- (in symbol IC-TI-TPS51120, part A) 100mA nom.; 200mA max.!

### Library data of the parts
C14 C18 C25 = C-X5R-10uF-10V-20%-0603: Capacitor Ceramic X5R 10uF 10V 20% 0603; Tolerance: 20%; Type: X5R; Value: 10uF
C15 C16 C26 C30 C31 C44 C47 = C-X5R-10uF-50V-20%-1210: Capacitor Ceramic X5R 10uF 50V 20% 1210; Tolerance: 20%; Type: X5R; Value: 10uF
C17 C43 = C-X7R-100nF-50V-20%-0603: Capacitor Ceramic X7R 100nF 50V 20% 0603; Tolerance: 20%; Type: X7R; Value: 100nF
C19 C32 C33 C41 = C-X7R-100nF-16V-10%-0402: Capacitor Ceramic X7R 100nF 16V 10% 0402; Tolerance: 10%; Type: X7R; Value: 100nF
C20 C27 = C-X5R-1uF-16V-20%-0603: Capacitor Ceramic X5R 1uF 16V 20% 0603; Tolerance: 20%; Type: X5R; Value: 1uF
C21-C24 C36-C39 = C-X5R-47uF-10V-20%-0805: Capacitor Ceramic X5R 47uF 10V 20% 0805; Tolerance: 20%; Type: X5R; Value: 47uF
C28 = C-X7R-1nF-50V-10%-0402: Capacitor Ceramic X7R 1nF 50V 10% 0402; Tolerance: 10%; Type: X7R; Value: 1nF
C29 = C-X7R-470pF-50V-10%-0402: Capacitor Ceramic X7R 470pF 50V 10% 0402; Tolerance: 10%; Type: X7R; Value: 470pF
C34 C35 = C-X7R-330nF-16V-10%-0805: Capacitor Ceramic X7R 330nF 16V 10% 0805; Tolerance: 10%; Type: X7R; Value: 330nF
C40 = C-X7R-680pF-50V-10%-0402: Capacitor Ceramic X7R 680pF 50V 10% 0402; Tolerance: 10%; Type: X7R; Value: 680pF
C42 C45 = C-X7R-10nF-25V-10%-0402: Capacitor Ceramic X7R 10nF 25V 10% 0402; Tolerance: 10%; Type: X7R; Value: 10nF
C46 = C-X7R-10nF-50V-10%-0402: Capacitor Ceramic X7R 10nF 50V 10% 0402; Tolerance: 10%; Type: X7R; Value: 10nF
D14 D16 = D-OnSemi-MM3Z15VT1G: Zener Diode, Vz=15V, 300mW, SOD-323; Manufacturer Name: OnSemi; Manufacturer Part No.: MM3Z15VT1G
IC1 = IC-ON-NCV4264-2ST50T3G: NCV4264-2ST50T3G LDO Regulator; Manufacturer Name: ON Semiconductor; Manufacturer Part No.: NCV4264-2ST50T3G
IC2 = IC-TI-TPS51120: Power Supply Controller; Manufacturer Name: Texas Instruments; Manufacturer Part No.: TPS51120
IC3 = IC-LIN-LTC2954CTS8-2#PBF: Push Button On/Off Controller; Manufacturer Name: Linear; Manufacturer Part No.: LTC2954CTS8-2#PBF
IC4 = IC-FAR-NC7SZ126M5X: NC7SZ126M5X  Buffer Three-State Output; Manufacturer Name: Fairchild Semiconductor; Manufacturer Part No.: NC7SZ126M5X
JP1 = CON-Samtec-TSW-101-07-G-D: Header male, 1x2 Pins, 2.54 mm pitch; Manufacturer Name: Samtec; Pitch: 2.54 mm; No. of ways: 1x2; Manufacturer Part no.: TSW-101-07-G-D
L4 = L-Bourns-SRP1038A-4R7M: Inductance 4.7uH 10A 20% 15.5 mOhm -40°C to125°C; Manufacturer Name: Bourns; Tolerance: 20%; Manufacturer Part No.: SRP1038A-4R7M; Value: 4.7uH; DC Resistance: 15.5 mOhm
L5 = L-Wurth-744771008-8.2uH-6.25A-20%: Inductance 8.2uH 6.25A 20%; Manufacturer Name: Wurth; Tolerance: 20%; Manufacturer Part No.: 744771008; Value: 8.2uH
L6 L7 = L-Laird-35F0121-0SR-10-10A-25%: Power Supply FB 10A; Tolerance: 25%; Rating: 10A; Value: 36R@100MHz
LED2 = LED-Avago-HSMS-C190: Surface mount LED red 20mA; Manufacturer Name: Avago
R4 R5 R16 = R-4.7R-63mW-5%-0402: Resistor 4.7 ohm 63mW 5% 0402; Rating: 63mW; Tolerance: 5%; Value: 4.7R
R6 R11 R13 R17 R20 R25-R27 R30-R32 R34 R37 R146 R147 = R-100KR-63mW-5%-0402: Resistor 100 Kohm 63mW 5% 0402; Value: 100KR; Rating: 63mW; Tolerance: 5%
R7 = R-0R-63mW-1%-0402: Resistor 0 ohm 63mW 1% 0402; Rating: 63mW; Tolerance: 1%; Value: 0R
R8 R18 R19 = R-10KR-63mW-5%-0402: Resistor 10 Kohm 63mW 5% 0402; Value: 10KR; Rating: 63mW; Tolerance: 5%
R9 = R-12mR-250mW-1%-1206: Resistor 12 mohm 250mW 1% 1206; Rating: 250mW; Tolerance: 1%; Value: 12mR
R10 R22 = R-24KR-63mW-1%-0402: Resistor 24 Kohm 63mW 1% 0402; Value: 24KR; Rating: 63mW; Tolerance: 1%
R12 = R-3.3KR-63mW-1%-0402: Resistor 3.3 Kohm 63mW 1% 0402; Value: 3.3KR; Rating: 63mW; Tolerance: 1%
R14 R15 R28 R29 R35 R36 = R-0R-63mW-1%-0603: Resistor 0 ohm 63mW 1% 0603; Rating: 63mW; Tolerance: 1%; Value: 0R
R21 = R-15mR-250mW-1%-1206: Resistor 15 mohm 250mW 1% 1206; Rating: 250mW; Tolerance: 1%; Value: 15mR
R23 = R-3.6KR-63mW-1%-0402: Resistor 3.6 Kohm 63mW 1% 0402; Value: 3.6KR; Rating: 63mW; Tolerance: 1%
R24 = R-560R-63mW-5%-0402: Resistor 560 ohm 63mW 5% 0402; Rating: 63mW; Tolerance: 5%; Value: 560R
R33 = R-470KR-63mW-5%-0402: Resistor 470 Kohm 63mW 5% 0402; Value: 470KR; Rating: 63mW; Tolerance: 5%
R68 = R-0R-63mW-1%-1210: Resistor 0 ohm 63mW 1% 1210; Rating: 63mW; Tolerance: 1%; Value: 0R
RA6 = RA-22R-63mW-5%-1206-div: Resistor Array 22 R 63mW 5% 1206; Tolerance: 5%; Power Dissipation: 63mW; Value: 22R
SW1 SW2 = SW-E-Switch-TL3340AF160QG: SWITCH TACT SUB MINI 160GF SMD Right Angle; Manufacturer Part No.: TL3340AF160QG; Manufacturer Name: E-Switch
T1 T4 = T-Fairchild-FDS6982AS-N: N-Channel PowerTrench SyncFET; Manufacturer Name: Fairchild; Manufacturer Part No.: FDS6982AS
T2 = T-IR-IRLML6401PbF-SOT-23: p-channel MOSFET, IRLML6401PbF; Manufacturer Name: International Rectifier; Manufacturer Part No.: IRLML6401PbF
T3 T6 T7 = T-Vishay-SI-1024X-N: Dual N-Channel 20V (D-S)  MOSFET; Manufacturer Name: Vishay
T5 = T-Diodes-DMP2022LSS-13-8-SOIC: p-channel MOSFET, DMP2022LSS-13; Manufacturer Name: DIODES; Manufacturer Part No.: DMP2022LSS-13
T8 T10 = T-DiodesInc-DMP4015SSS-13: P-channel MOSFET, DMP4015SSS-13; Manufacturer Name: Diodes Inc; Manufacturer Part No.: DMP4015SSS-13
T9 T11 = T-Diodes-BSS138-7-F: N-channel MOSFET, BSS138-7-F; Manufacturer Name: Diodes; Manufacturer Part No.: BSS138-7-F
X1 = CON-JAE-MM70-314-310B1-314-0.5mm: as X1 on sheet Audio
X5 = CON-Samtec-SSW-103-01-G-D: Receptacle Female Socket, 2x3 Pins, 2.54mm pitch; Manufacturer Name: Samtec; No. of ways: 2x3; Pitch: 2.54mm
X6 = CON-Molex-22-11-2032: Header with Friction Lock; Manufacturer Name: Molex; No. of ways: 3; Manufacturer Part No.: 22-11-2032